# Altium project CATS-EUROC.PrjPcb
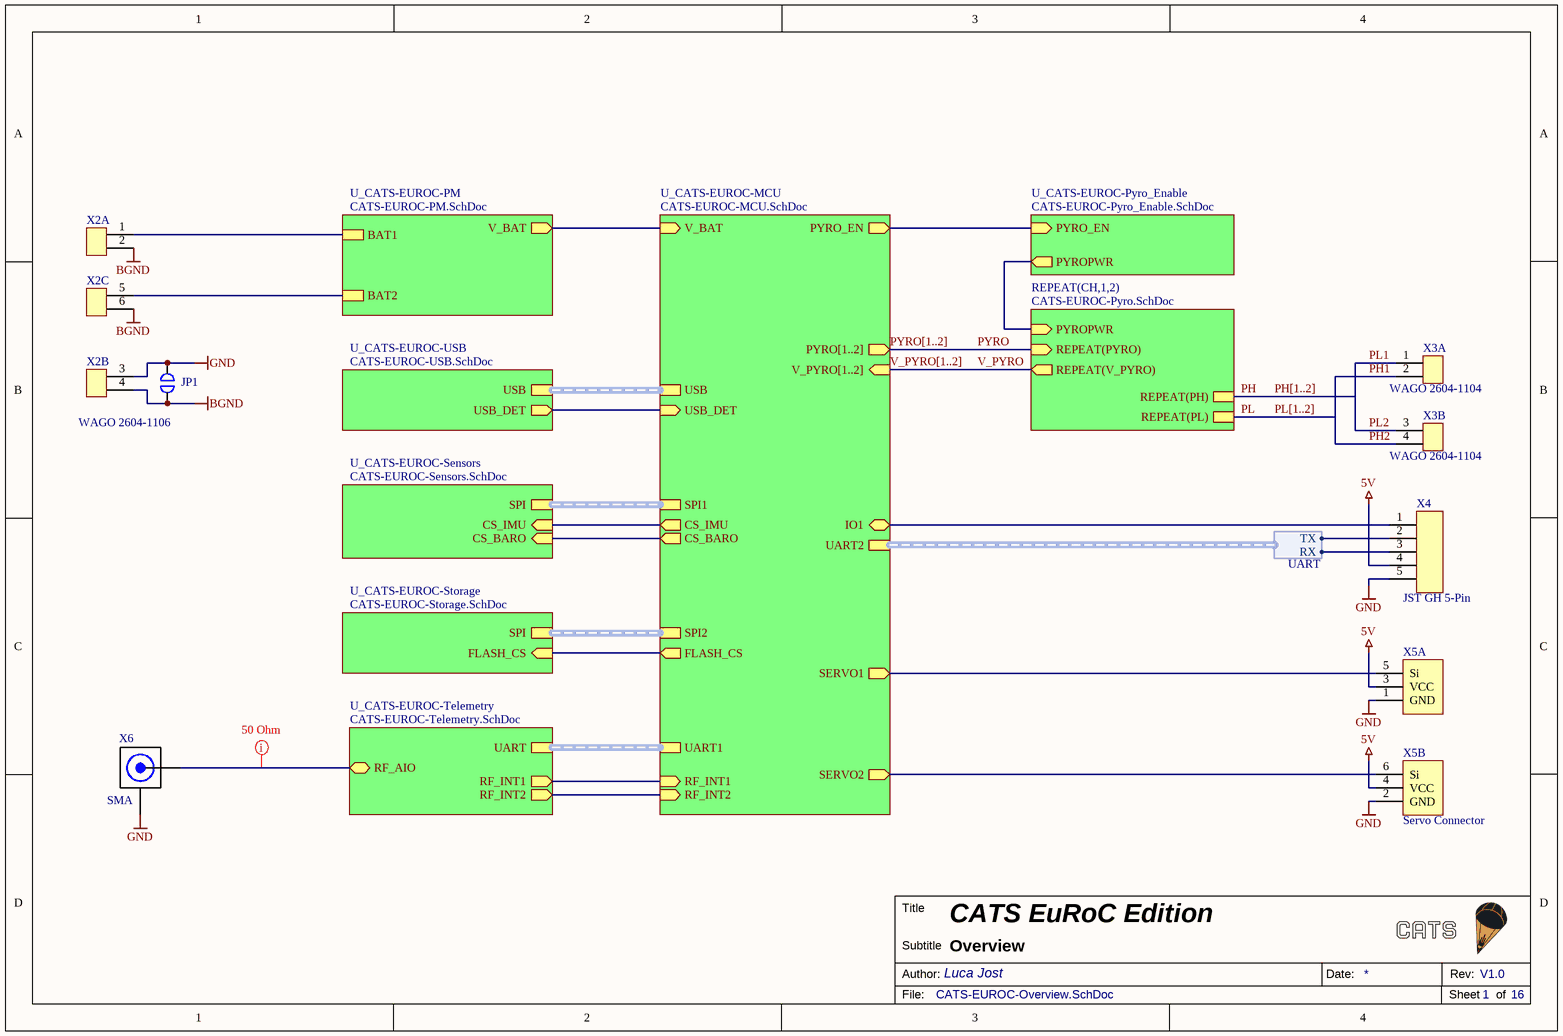
[diagram p0: CATS-EUROC-Overview.SchDoc]
16 sheets, 164 parts. Net scope: hierarchical (ports join the sheet entries above them; power ports are global).
Board file: CATS-EUROC.PcbDoc
Sheets:
  CATS-EUROC-Overview.SchDoc
    U_CATS-EUROC-Sensors = CATS-EUROC-Sensors.SchDoc
      U_CATS-EUROC-IMU = CATS-EUROC-IMU.SchDoc
      U_CATS-EUROC-Baro = CATS-EUROC-Baro.SchDoc
    U_CATS-EUROC-MCU = CATS-EUROC-MCU.SchDoc
    CH1 = CATS-EUROC-Pyro.SchDoc
    CH2 = CATS-EUROC-Pyro.SchDoc
    U_CATS-EUROC-USB = CATS-EUROC-USB.SchDoc
    U_CATS-EUROC-Pyro_Enable = CATS-EUROC-Pyro_Enable.SchDoc
    U_CATS-EUROC-Storage = CATS-EUROC-Storage.SchDoc
    U_CATS-EUROC-PM = CATS-EUROC-PM.SchDoc
    U_CATS-EUROC-Telemetry = CATS-EUROC-Telemetry.SchDoc
      U_MCU = CATS-EUROC-Radio_MCU.SchDoc
      U_RF = CATS-EUROC-RF.SchDoc
        U_Frontend = CATS-EUROC-Frontend.SchDoc
        U_Radio = CATS-EUROC-Radio.SchDoc
      U_GNSS = CATS-EUROC-GNSS.SchDoc

## Sheet CATS-EUROC-Overview.SchDoc: CATS EuRoC Edition
size A4; DocumentNumber: Overview; Revision: V1.0; SheetNumber: 1; SheetTotal: 16; Author: Luca Jost; Subtitle: Overview

### Parts
JP1  Jumper  [SMD Solder Jumper 1x2mm]  (value not drawn)  (no BOM)
X2  WAGO 2604-1106  [THT PCB Terminal Wago 2604-1106]  (value not drawn)  (parts A,B,C of 3)
X3  WAGO 2604-1104  [THT PCB Terminal Wago 2604-1104]  (parts A,B of 2)
X4  JST GH 5-Pin  [SMD Connector JST GH-5]
X5  Servo Connector  [THT Stiftleiste 6-Pol (2x3) 90°]  (value not drawn)  (parts A,B of 2)
X6  SMA  [THT Buchse SMA Female]

### Sub-sheets
REPEAT(CH,1,2) = CATS-EUROC-Pyro.SchDoc: REPEAT(V_PYRO) (out), REPEAT(PYRO) (in), REPEAT(PH), REPEAT(PL), PYROPWR (in)
U_CATS-EUROC-MCU = CATS-EUROC-MCU.SchDoc: SPI1 (harness SPI), UART1 (harness UART), USB (harness USB), V_PYRO[1..2] (in), PYRO[1..2] (out), IO1 (bidir), SERVO1 (out), SERVO2 (out), USB_DET (in), V_BAT (in), CS_IMU (out), CS_BARO (out), RF_INT1 (in), RF_INT2 (in), PYRO_EN (out), SPI2 (harness SPI), FLASH_CS (out), UART2 (harness UART)
U_CATS-EUROC-PM = CATS-EUROC-PM.SchDoc: V_BAT (out), BAT1, BAT2
U_CATS-EUROC-Pyro_Enable = CATS-EUROC-Pyro_Enable.SchDoc: PYRO_EN (in), PYROPWR (out)
U_CATS-EUROC-Sensors = CATS-EUROC-Sensors.SchDoc: CS_IMU (in), SPI, CS_BARO (in)
U_CATS-EUROC-Storage = CATS-EUROC-Storage.SchDoc: SPI (harness SPI), FLASH_CS (in)
U_CATS-EUROC-Telemetry = CATS-EUROC-Telemetry.SchDoc: UART, RF_INT1 (out), RF_INT2 (out), RF_AIO (bidir)
U_CATS-EUROC-USB = CATS-EUROC-USB.SchDoc: USB (harness USB), USB_DET (out)

### Harnesses
UART: TX, RX

### Nets
5V: X4.4 X5.3(VCC) X5.4(VCC)
BGND: JP1.2 X2.2 X2.4 X2.6
GND: JP1.1 X2.3 X4.5 X5.1(GND) X5.2(GND) X6.2(RF)
CS_BARO: sheet U_CATS-EUROC-Sensors/CS_BARO, sheet U_CATS-EUROC-MCU/CS_BARO
CS_IMU: sheet U_CATS-EUROC-Sensors/CS_IMU, sheet U_CATS-EUROC-MCU/CS_IMU
FLASH_CS: sheet U_CATS-EUROC-MCU/FLASH_CS, sheet U_CATS-EUROC-Storage/FLASH_CS
INT1: sheet U_CATS-EUROC-MCU/RF_INT1, sheet U_CATS-EUROC-Telemetry/RF_INT1
INT2: sheet U_CATS-EUROC-MCU/RF_INT2, sheet U_CATS-EUROC-Telemetry/RF_INT2
IO1: X4.1 ; sheet U_CATS-EUROC-MCU/IO1
PH: sheet REPEAT(CH,1,2)/REPEAT(PH)
PH1: X3.2 X3.4 ; sheet REPEAT(CH,1,2)/PYROPWR, sheet U_CATS-EUROC-Pyro_Enable/PYROPWR  [also labelled PH2]
PL: sheet REPEAT(CH,1,2)/REPEAT(PL)
PL1: X3.1
PL2: X3.3
PYRO: sheet REPEAT(CH,1,2)/REPEAT(PYRO)
PYRO_EN: sheet U_CATS-EUROC-MCU/PYRO_EN, sheet U_CATS-EUROC-Pyro_Enable/PYRO_EN
SERVO1: X5.5(Si) ; sheet U_CATS-EUROC-MCU/SERVO1
SERVO2: X5.6(Si) ; sheet U_CATS-EUROC-MCU/SERVO2
UART2_RX: X4.3 ; sheet U_CATS-EUROC-MCU/UART2.RX
UART2_TX: X4.2 ; sheet U_CATS-EUROC-MCU/UART2.TX
USB_DET: sheet U_CATS-EUROC-MCU/USB_DET, sheet U_CATS-EUROC-USB/USB_DET
V_BAT: sheet U_CATS-EUROC-MCU/V_BAT, sheet U_CATS-EUROC-PM/V_BAT
V_PYRO: sheet REPEAT(CH,1,2)/REPEAT(V_PYRO)
NetD1_A: X2.1 ; sheet U_CATS-EUROC-PM/BAT1
NetD2_A: X2.5 ; sheet U_CATS-EUROC-PM/BAT2
NetFL1_5: X6.1(RF) ; sheet U_CATS-EUROC-Telemetry/RF_AIO

### Buses and harness runs
bus PH[1..2]
bus PL[1..2]
bus PYRO[1..2] = sheet U_CATS-EUROC-MCU/PYRO[1..2]
bus V_PYRO[1..2] = sheet U_CATS-EUROC-MCU/V_PYRO[1..2]
harness sheet U_CATS-EUROC-MCU/SPI1 = sheet U_CATS-EUROC-Sensors/SPI
harness sheet U_CATS-EUROC-MCU/SPI2 = sheet U_CATS-EUROC-Storage/SPI
harness sheet U_CATS-EUROC-MCU/UART1 = sheet U_CATS-EUROC-Telemetry/UART
harness sheet U_CATS-EUROC-MCU/USB = sheet U_CATS-EUROC-USB/USB

### Layout directives
rule Impedance Constraint [Min = 50.00    Max = 50.00    ]; net class RF-Line 50: NetFL1_5

### Notes on the sheet
- Title
- Author:
- Subtitle
- Date:
- Rev:
- File:
- Sheet
- of

### Library data of the parts
JP1 = Jumper-1: Single Position Jumper
X2 = WAGO 2604-1106: PCB terminal blocks with levers and Push-in CAGE CLAMP® connection; ComponentLink1Description: Datasheet; ComponentLink1URL: https://www.wago.com/us/pcb-interconnect/pcb-terminal-block/p/2604-1106
X3 = WAGO 2604-1104: PCB terminal blocks with levers and Push-in CAGE CLAMP® connection; ComponentLink1Description: Datasheet; ComponentLink1URL: https://www.wago.com/us/pcb-interconnect/pcb-terminal-block/p/2604-1106
X4 = JST GH 5-Pin: Connector Header Surface Mount, Right Angle 4 position 0.049" (1.25mm); ComponentLink1Description: Datasheet; ComponentLink1URL: https://www.jst-mfg.com/product/pdf/eng/eGH.pdf
X5 = Servo Connector Dual: 6 Pin header for PWM servos
X6 = SMA Connector: Female SMA Connector THT; Digikey: 931-1361-ND

## Sheet CATS-EUROC-Sensors.SchDoc: CATS EuRoC Edition
size A4; DocumentNumber: Overview; Revision: V1.0; SheetNumber: 5; SheetTotal: 16; Author: Luca Jost; Subtitle: Sensors
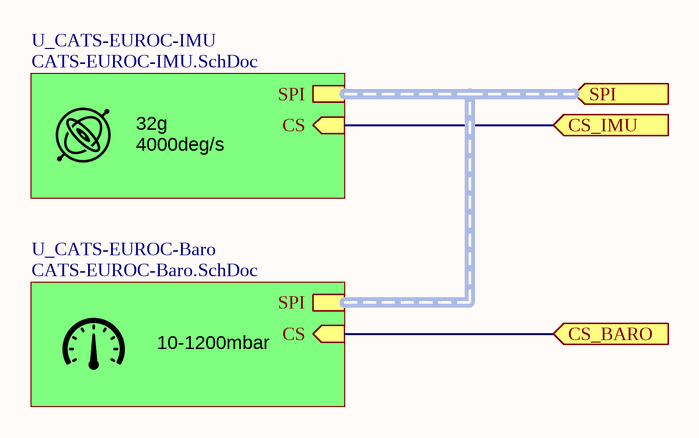
[diagram p1: CATS-EUROC-Sensors.SchDoc]

### Sub-sheets
U_CATS-EUROC-Baro = CATS-EUROC-Baro.SchDoc: SPI (harness SPI), CS (in)
U_CATS-EUROC-IMU = CATS-EUROC-IMU.SchDoc: SPI (harness SPI), CS (in)

### Ports
CS_BARO (in), CS_IMU (in), SPI (in)

### Nets
CS_BARO: port CS_BARO, sheet U_CATS-EUROC-Baro/CS
CS_IMU: port CS_IMU, sheet U_CATS-EUROC-IMU/CS

### Buses and harness runs
harness port SPI = sheet U_CATS-EUROC-Baro/SPI = sheet U_CATS-EUROC-IMU/SPI

### Notes on the sheet
- 4000deg/s
- 32g
- 10-1200mbar
- Title
- Author:
- Subtitle
- Date:
- Rev:
- File:
- Sheet
- of

## Sheet CATS-EUROC-IMU.SchDoc: CATS EuRoC Edition
size A4; DocumentNumber: Overview; Revision: V1.0; SheetNumber: 6; SheetTotal: 16; Author: Luca Jost; Subtitle: Inertial Measurement Unit
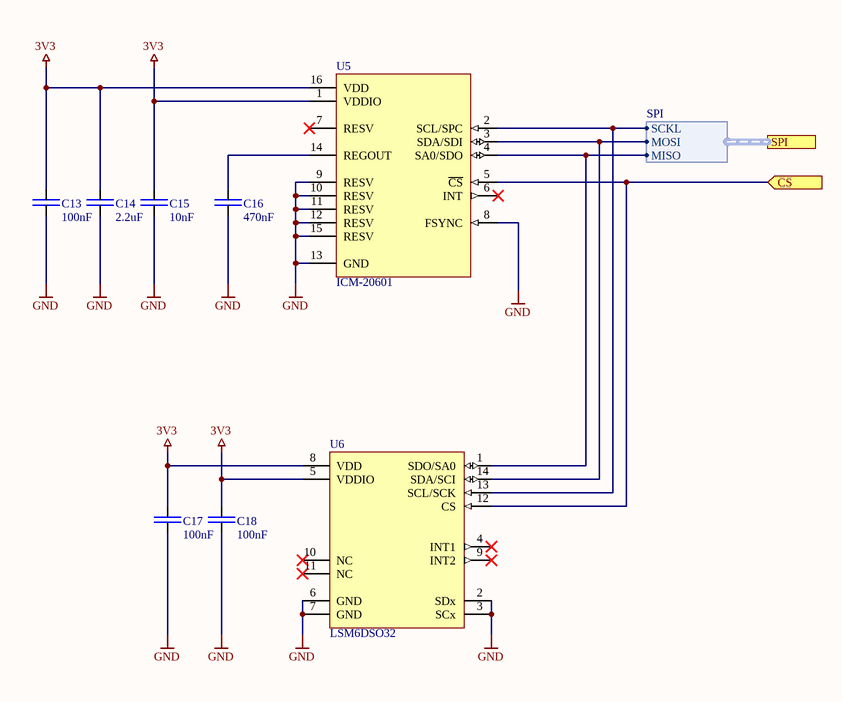
[diagram p2: CATS-EUROC-IMU.SchDoc]

### Parts
C13  100nF  [SMD Keramikkondensator 0402]
C14  2.2uF  [SMD Keramikkondensator 0402]
C15  10nF  [SMD Keramikkondensator 0402]
C16  470nF  [SMD Keramikkondensator 0402]
C17  100nF  [SMD Keramikkondensator 0402]
C18  100nF  [SMD Keramikkondensator 0402]
U5  ICM-20601  [SMD IC LGA-16 5/3]
U6  LSM6DSO32  [SMD IC LGA-14]

### Ports
CS (in), SPI (harness SPI)

### Harnesses
SPI: SCKL, MOSI, MISO

### Nets
3V3: C13.2 C14.2 C15.2 C17.2 C18.2 U5.1(VDDIO) U5.16(VDD) U6.5(VDDIO) U6.8(VDD)
GND: C13.1 C14.1 C15.1 C16.1 C17.1 C18.1 U5.8(FSYNC) U5.9(RESV) U5.10(RESV) U5.11(RESV) U5.12(RESV) U5.13(GND) U5.15(RESV) U6.2(SDx) U6.3(SCx) U6.6(GND) U6.7(GND)
CS_IMU: U5.5(~{CS}) U6.12(CS) ; port CS
SPI1_MISO: U5.4(SA0/SDO) U6.1(SDO/SA0) ; port SPI.MISO
SPI1_MOSI: U5.3(SDA/SDI) U6.14(SDA/SCI) ; port SPI.MOSI
SPI1_SCK: U5.2(SCL/SPC) U6.13(SCL/SCK) ; port SPI.SCKL
NetC16_2: C16.2 U5.14(REGOUT)

Not connected (* = marked no-connect by the designer): U5 6(INT)* 7(RESV)*; U6 4(INT1)* 9(INT2)* 10(NC)* 11(NC)*

### Notes on the sheet
- Title
- Author:
- Subtitle
- Date:
- Rev:
- File:
- Sheet
- of

### Library data of the parts
C13 C17 C18 = E6 - 100nF: SMD Ceramic Capacitor E6; Unit Price: 0.01; Number: -; Supplier: -; JLC: C307331
C14 = E6 - 2.2uF: SMD Ceramic Capacitor E6; Unit Price: 0.01; Number: -; Supplier: -; JLC: C12530
C15 = E6 - 10nF: SMD Ceramic Capacitor E6; Unit Price: 0.01; Number: -; Supplier: -; JLC: C15195
C16 = E6 - 470nF: SMD Ceramic Capacitor E6; Unit Price: 0.01; Number: -; Supplier: -; JLC: C47339
U5 = ICM-20601: World’s First Wide-Range 6-Axis MotionTracking Device for High Speed Applications /; ComponentLink1Description: Datasheet; ComponentLink1URL: https://www.invensense.com/wp-content/uploads/2015/12/DS-000184-ICM-20600-v1.0.pdf; Digikey: 1428-1058-1-ND
U6 = LSM6DSO32: iNEMO inertial module / ±4/±8/±16/±32 g / ±125/±250/±500/±1000/±2000 dps; ComponentLink1Description: Datasheet; ComponentLink1URL: https://www.st.com/resource/en/datasheet/lsm6dso32.pdf; Digikey: 497-LSM6DSO32CT-ND; Mouser: 511-LSM6DSO32TR; Farnell: 3527117

## Sheet CATS-EUROC-Baro.SchDoc: CATS EuRoC Edition
size A4; DocumentNumber: Overview; Revision: V1.0; SheetNumber: 7; SheetTotal: 16; Author: Luca Jost; Subtitle: Barometer
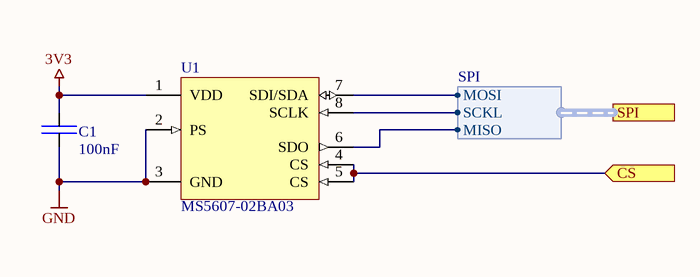
[diagram p3: CATS-EUROC-Baro.SchDoc]

### Parts
C1  100nF  [SMD Keramikkondensator 0402]
U1  MS5607-02BA03  [SMD IC BARO MS5607]

### Ports
CS (in), SPI (harness SPI)

### Harnesses
SPI: SCKL, MOSI, MISO

### Nets
3V3: C1.2 U1.1(VDD)
GND: C1.1 U1.2(PS) U1.3(GND)
CS_BARO: U1.4(CS) U1.5(CS) ; port CS
SPI1_MISO: U1.6(SDO) ; port SPI.MISO
SPI1_MOSI: U1.7(SDI/SDA) ; port SPI.MOSI
SPI1_SCK: U1.8(SCLK) ; port SPI.SCKL

### Notes on the sheet
- Title
- Author:
- Subtitle
- Date:
- Rev:
- File:
- Sheet
- of

### Library data of the parts
C1 = E6 - 100nF: SMD Ceramic Capacitor E6; Unit Price: 0.01; Number: -; Supplier: -; JLC: C307331
U1 = MS5607-02BA03: Barometric Pressure Sensor, with stainless / steel cap; ComponentLink1Description: Datasheet; ComponentLink1URL: https://www.te.com/commerce/DocumentDelivery/DDEController?Action=srchrtrv&DocNm=MS5607-02BA03&DocType=Data+Sheet&DocLang=English; Digikey: 223-1198-1-ND

## Sheet CATS-EUROC-MCU.SchDoc: CATS EuRoC Edition
size A4; DocumentNumber: Overview; Revision: V1.0; SheetNumber: 2; SheetTotal: 16; Author: Luca Jost; Subtitle: Microcontroller
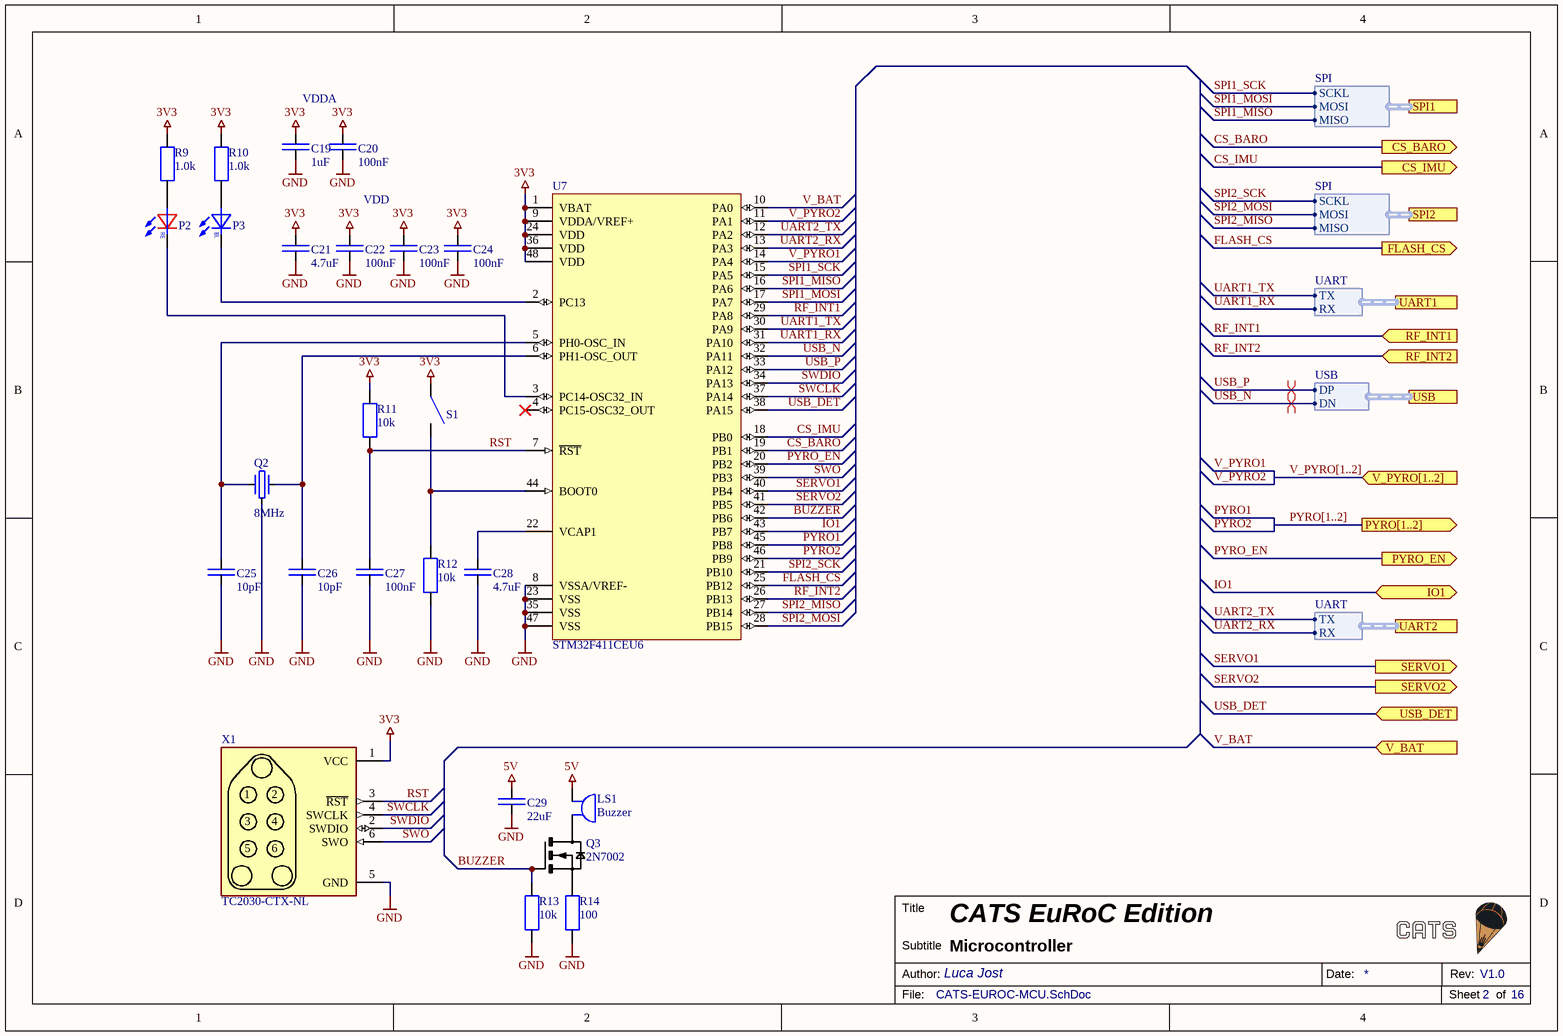
[diagram p4: CATS-EUROC-MCU.SchDoc]

### Parts
C19  1uF  [SMD Keramikkondensator 0402]
C20  100nF  [SMD Keramikkondensator 0402]
C21  4.7uF  [SMD Keramikkondensator 0402]
C22  100nF  [SMD Keramikkondensator 0402]
C23  100nF  [SMD Keramikkondensator 0402]
C24  100nF  [SMD Keramikkondensator 0402]
C25  10pF  [SMD Keramikkondensator 0402]
C26  10pF  [SMD Keramikkondensator 0402]
C27  100nF  [SMD Keramikkondensator 0402]
C28  4.7uF  [SMD Keramikkondensator 0402]
C29  22uF  [SMD Keramikkondensator 0805]
LS1  Buzzer  [SMD BUZZER CMT-8504]
P2  LED  [SMD LED 0603]  (value not drawn)
P3  LED  [SMD LED 0603]  (value not drawn)
Q2  8MHz  [SMD Crystal 3.2X2.5X0.8]
Q3  2N7002  [SMD MOSFET SOT-23]
R9  1.0k  [SMD Widerstand 0402]
R10  1.0k  [SMD Widerstand 0402]
R11  10k  [SMD Widerstand 0402]
R12  10k  [SMD Widerstand 0402]
R13  10k  [SMD Widerstand 0402]
R14  100  [SMD Widerstand 0805]
S1  SMD-Button  [SMD Button 2.5x3x1.2]  (value not drawn)
U7  STM32F411CEU6  [SMD IC QFN-48]
X1  TC2030-CTX-NL  [SMD Connector TC2030]  (no BOM)

### Ports
CS_BARO (out), CS_IMU (out), FLASH_CS (out), IO1 (bidir), PYRO[1..2] (out), PYRO_EN (out), RF_INT1 (in), RF_INT2 (in), SERVO1 (out), SERVO2 (out), SPI1 (harness SPI), SPI2 (harness SPI), UART1 (harness UART), UART2 (harness UART), USB (harness USB), USB_DET (in), V_BAT (in), V_PYRO[1..2] (in)

### Harnesses
SPI: SCKL, MOSI, MISO
UART: TX, RX
USB: DP, DN

### Nets
3V3: C19.2 C20.2 C21.2 C22.2 C23.2 C24.2 R9.2 R10.2 R11.2 S1.1 U7.1(VBAT) U7.9(VDDA/VREF+) U7.24(VDD) U7.36(VDD) U7.48(VDD) X1.1(VCC)
5V: C29.2 LS1.1
GND: C19.1 C20.1 C21.1 C22.1 C23.1 C24.1 C25.1 C26.1 C27.1 C28.1 C29.1 Q2.3 R12.1 R13.1 R14.1 U7.8(VSSA/VREF-) U7.23(VSS) U7.35(VSS) U7.47(VSS) X1.5(GND)
BUZZER: Q3.G R13.2 U7.42(PB6)
CS_BARO: U7.19(PB1) ; port CS_BARO
CS_IMU: U7.18(PB0) ; port CS_IMU
FLASH_CS: U7.25(PB12) ; port FLASH_CS
IO1: U7.43(PB7) ; port IO1
PYRO1: U7.45(PB8)
PYRO2: U7.46(PB9)
PYRO_EN: U7.20(PB2) ; port PYRO_EN
RF_INT1: U7.29(PA8) ; port RF_INT1  [project net INT1]
RF_INT2: U7.26(PB13) ; port RF_INT2  [project net INT2]
RST: C27.2 R11.1 U7.7(~{RST}) X1.3(~{RST})
SERVO1: U7.40(PB4) ; port SERVO1
SERVO2: U7.41(PB5) ; port SERVO2
SPI1_MISO: U7.16(PA6) ; port SPI1.MISO
SPI1_MOSI: U7.17(PA7) ; port SPI1.MOSI
SPI1_SCK: U7.15(PA5) ; port SPI1.SCKL
SPI2_MISO: U7.27(PB14) ; port SPI2.MISO
SPI2_MOSI: U7.28(PB15) ; port SPI2.MOSI
SPI2_SCK: U7.21(PB10) ; port SPI2.SCKL
SWCLK: U7.37(PA14) X1.4(SWCLK)
SWDIO: U7.34(PA13) X1.2(SWDIO)
SWO: U7.39(PB3) X1.6(SWO)
UART1_RX: U7.31(PA10) ; port UART1.RX  [project net TX2]
UART1_TX: U7.30(PA9) ; port UART1.TX  [project net RX2]
UART2_RX: U7.13(PA3) ; port UART2.RX
UART2_TX: U7.12(PA2) ; port UART2.TX
USB_DET: U7.38(PA15) ; port USB_DET
USB_N: U7.32(PA11) ; port USB.DN
USB_P: U7.33(PA12) ; port USB.DP
V_BAT: U7.10(PA0) ; port V_BAT
V_PYRO1: U7.14(PA4)
V_PYRO2: U7.11(PA1)
NetC25_2: C25.2 Q2.1 U7.5(PH0-OSC_IN)
NetC26_2: C26.2 Q2.2 U7.6(PH1-OSC_OUT)
NetC28_2: C28.2 U7.22(VCAP1)
NetLS1_2: LS1.2 Q3.D
NetP2_A: P2.A R9.1
NetP2_K: P2.K U7.3(PC14-OSC32_IN)
NetP3_A: P3.A R10.1
NetP3_K: P3.K U7.2(PC13)
NetQ3_S: Q3.S R14.2
NetR12_2: R12.2 S1.2 U7.44(BOOT0)

Not connected (* = marked no-connect by the designer): U7 4(PC15-OSC32_OUT)*

### Buses and harness runs
bus PYRO[1..2] = port PYRO[1..2]
bus V_PYRO[1..2] = port V_PYRO[1..2]

### Layout directives
differential pair: USB_N, USB_P

### Notes on the sheet
- VDDA
- VDD
- Title
- Author:
- Subtitle
- Date:
- Rev:
- File:
- Sheet
- of
- (in symbol LED) BL; RE

### Library data of the parts
C19 = E6 - 1uF: SMD Ceramic Capacitor E6; Unit Price: 0.01; Number: -; Supplier: -; JLC: C52923
C20 C22-C24 C27 = E6 - 100nF: SMD Ceramic Capacitor E6; Unit Price: 0.01; Number: -; Supplier: -; JLC: C307331
C21 C28 = E6 - 4.7uF: SMD Ceramic Capacitor E6; Unit Price: 0.01; Number: -; Supplier: -; JLC: C23733
C25 C26 = E6 - 10pF: SMD Ceramic Capacitor E6; Unit Price: 0.01; Number: -; Supplier: -; JLC: C32949
C29 = E6 - 22uF: SMD Ceramic Capacitor E6; Unit Price: 0.01; Number: -; Supplier: -; JLC: C45783
LS1 = Buzzer: Buzzers Indicator, Internally Driven Piezo 12V 10mA 3kHz 100dB @ 12V, 10cm Through Hole PC Pins; Digikey: 2104-IP303012-1-ND; ComponentLink1Description: Datasheet; ComponentLink1URL: https://dbunlimitedco.com/images/product_images/2D-Drawings/IP303012-1.pdf
P2 P3 = LED: Color LED
Q2 = Crystal: SMD Crystal Resonators 8MHz ±10ppm SMD,3.2x2.5mm; Digikey: 535-15255-1-ND; JLC: C2682775
Q3 = 2N7002: MOSFET N-Channel 20V / 115mA; Item Description: N-Channel MOSFET; Digikey: 2N7002NCT-ND; Price: 0.32; ComponentLink1Description: Datasheet; ComponentLink1URL: https://www.onsemi.com/pub/Collateral/NDS7002A-D.PDF; JLC: C15127
R9 R10 = E24 - 1.0k: SMD Chip Resistor E24; Unit Price: 0.01; Number: -; Supplier: -; JLC: C11702
R11-R13 = E24 - 10k: SMD Chip Resistor E24; Unit Price: 0.01; Number: -; Supplier: -; JLC: C25744
R14 = E24 - 100: SMD Chip Resistor E24; Unit Price: 0.01; Number: -; Supplier: -; JLC: C515718
S1 = Button 3mmx2.5mm: Button SPST; Digikey: SW1020TR-ND; JLC: C128937
U7 = STM32F411CEU6: ARM® Cortex®-M4 series Microcontroller IC 32-Bit 100MHz 512KB (512K x 8) FLASH 48-UFQFPN (7x7); Digikey: 497-14907-ND; JLC: C60420; ComponentLink1Description: Datasheet; ComponentLink1URL: https://datasheet.lcsc.com/lcsc/1809291612_STMicroelectronics-STM32F411CEU6_C60420.pdf
X1 = TC2030-CTX-NL: Tag-Connect for ARM-Cortex (6-Pin)

## Sheet CATS-EUROC-Pyro.SchDoc: CATS EuRoC Edition
size A4; DocumentNumber: Overview; Revision: V1.0; SheetNumber: 10; SheetTotal: 16; Author: Luca Jost; Subtitle: Pyro Channel
Used 2 times, as channels CH1, CH2. Parts and nets are listed once, with the designators drawn on the sheet.
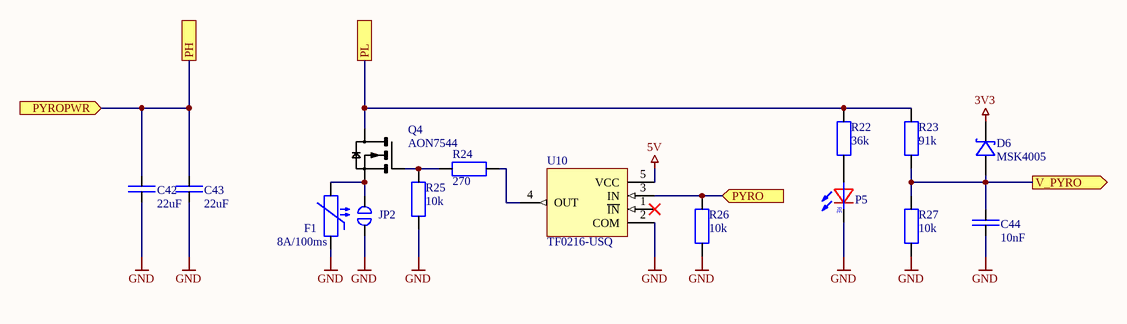
[diagram p5: CATS-EUROC-Pyro.SchDoc]

### Parts
C42  22uF  [SMD Keramikkondensator 0805]
C43  22uF  [SMD Keramikkondensator 0805]
C44  10nF  [SMD Keramikkondensator 0402]
D6  MSK4005  [SMD Diode SOD-523]
F1  8A/100ms  [SMD PPTC-Fuse 1206]
JP2  Jumper  [SMD Solder Jumper 1x2mm]  (value not drawn)  (no BOM)
P5  LED  [SMD LED 0603]  (value not drawn)
Q4  AON7544  [SMD MOSFET DFN 3x3 EP]
R22  36k  [SMD Widerstand 0402]
R23  91k  [SMD Widerstand 0402]
R24  270  [SMD Widerstand 0402]
R25  10k  [SMD Widerstand 0402]
R26  10k  [SMD Widerstand 0402]
R27  10k  [SMD Widerstand 0402]
U10  TF0216-USQ  [SMD IC SOT-23-5]

### Ports
PH, PL, PYRO (in), PYROPWR (in), V_PYRO (out)

### Nets
3V3: D6.K
5V: U10.5(VCC)
GND: C42.1 C43.1 C44.1 F1.2 JP2.2 P5.K R25.1 R26.1 R27.1 U10.2(COM)
PH: C42.2 C43.2 ; port PH, port PYROPWR
PL: Q4.D R22.2 R23.2 ; port PL
PYRO: R26.2 U10.3(IN) ; port PYRO
V_PYRO: C44.2 D6.A R23.1 R27.2 ; port V_PYRO
NetF1_1: F1.1 JP2.1 Q4.S
NetP5_A: P5.A R22.1
NetQ4_G: Q4.G R24.1 R25.2
NetR24_2: R24.2 U10.4(OUT)

Not connected (* = marked no-connect by the designer): U10 1(~{IN})*

### Channels
CH1: designators end in _CH1; ports PH=PH1 PL=PL1 PYRO=PYRO1 PYROPWR=PH1 V_PYRO=V_PYRO1
CH2: designators end in _CH2; ports PH=PH1 PL=PL2 PYRO=PYRO2 PYROPWR=PH1 V_PYRO=V_PYRO2

### Notes on the sheet
- Title
- Author:
- Subtitle
- Date:
- Rev:
- File:
- Sheet
- of
- (in symbol LED) RE

### Library data of the parts
C42 C43 = E6 - 22uF: SMD Ceramic Capacitor E6; Unit Price: 0.01; Number: -; Supplier: -; JLC: C45783
C44 = E6 - 10nF: SMD Ceramic Capacitor E6; Unit Price: 0.01; Number: -; Supplier: -; JLC: C15195
D6 = MSK4005: SOD-523 Schottky Barrier Diode; ComponentLink1Description: Datasheet; ComponentLink1URL: https://datasheet.lcsc.com/lcsc/1912111437_Shikues-MSK4005_C345957.pdf; JLC: C345957
F1 = nSMD100-16V: 16V 1A 100A 1.8A 1206 Resettable; JLC: C70082; ComponentLink1Description: Datasheet; ComponentLink1URL: https://datasheet.lcsc.com/lcsc/1810261625_TECHFUSE-nSMD100-16V_C70082.pdf
JP2 = Jumper-1: Single Position Jumper
P5 = LED: Color LED
Q4 = AON7544: N-Channel 30V 30A Surface Mount 8-DFN (3x3); ComponentLink1Description: Datasheet; ComponentLink1URL: https://datasheet.lcsc.com/lcsc/1912111437_Alpha---Omega-Semicon-AON7544_C315567.pdf; JLC: C315567
R22 = E24 - 36k: SMD Chip Resistor E24; Unit Price: 0.01; Number: -; Supplier: -; JLC: C43676
R23 = E24 - 91k: SMD Chip Resistor E24; Unit Price: 0.01; Number: -; Supplier: -; JLC: C4147
R24 = E24 - 270: SMD Chip Resistor E24; Unit Price: 0.01; Number: -; Supplier: -; JLC: C25099
R25-R27 = E24 - 10k: SMD Chip Resistor E24; Unit Price: 0.01; Number: -; Supplier: -; JLC: C25744
U10 = TF0216-USQ: SOT-23-5L Gate Drive IC; JLC: C2683769; ComponentLink1Description: Datasheet; ComponentLink1URL: https://datasheet.lcsc.com/lcsc/2106070334_TFSS-TF0216-USQ_C2683769.pdf

## Sheet CATS-EUROC-USB.SchDoc: CATS EuRoC Edition
size A4; DocumentNumber: Overview; Revision: V1.0; SheetNumber: 4; SheetTotal: 16; Author: Luca Jost; Subtitle: USB Connector
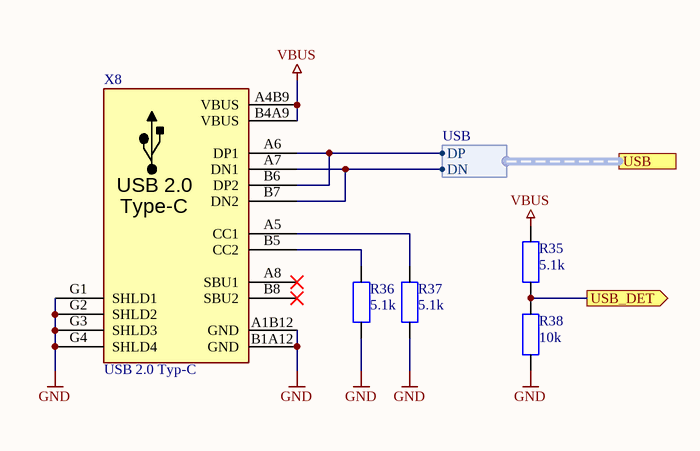
[diagram p6: CATS-EUROC-USB.SchDoc]

### Parts
R35  5.1k  [SMD Widerstand 0402]
R36  5.1k  [SMD Widerstand 0402]
R37  5.1k  [SMD Widerstand 0402]
R38  10k  [SMD Widerstand 0402]
X8  USB 2.0 Typ-C  [THT USB-C Socket (A40-00119)]

### Ports
USB (harness USB), USB_DET (out)

### Harnesses
USB: DP, DN

### Nets
GND: R36.1 R37.1 R38.2 X8.A1B12(GND) X8.B1A12(GND) X8.G1(SHLD1) X8.G2(SHLD2) X8.G3(SHLD3) X8.G4(SHLD4)
VBUS: R35.1 X8.A4B9(VBUS) X8.B4A9(VBUS)
USB_DET: R35.2 R38.1 ; port USB_DET
USB_N: X8.A7(DN1) X8.B7(DN2) ; port USB.DN
USB_P: X8.A6(DP1) X8.B6(DP2) ; port USB.DP
NetR36_2: R36.2 X8.B5(CC2)
NetR37_2: R37.2 X8.A5(CC1)

Not connected (* = marked no-connect by the designer): X8 A8(SBU1)* B8(SBU2)*

### Notes on the sheet
- Title
- Author:
- Subtitle
- Date:
- Rev:
- File:
- Sheet
- of
- (in symbol USB Type-C USB 2.0) USB 2.0; Type-C

### Library data of the parts
R35-R37 = E24 - 5.1k: SMD Chip Resistor E24; Unit Price: 0.01; Number: -; Supplier: -; JLC: C25905
R38 = E24 - 10k: SMD Chip Resistor E24; Unit Price: 0.01; Number: -; Supplier: -; JLC: C25744
X8 = USB Type-C USB 2.0: Typ-C; aliExpress: 33045191307; Digikey: 2073-USB4105-GF-ACT-ND; Farnell: 3583366; JLC: C167321

## Sheet CATS-EUROC-Pyro_Enable.SchDoc: CATS EuRoC Edition
size A4; DocumentNumber: Overview; Revision: V1.0; SheetNumber: 9; SheetTotal: 16; Author: Luca Jost; Subtitle: Pyro Power Enable
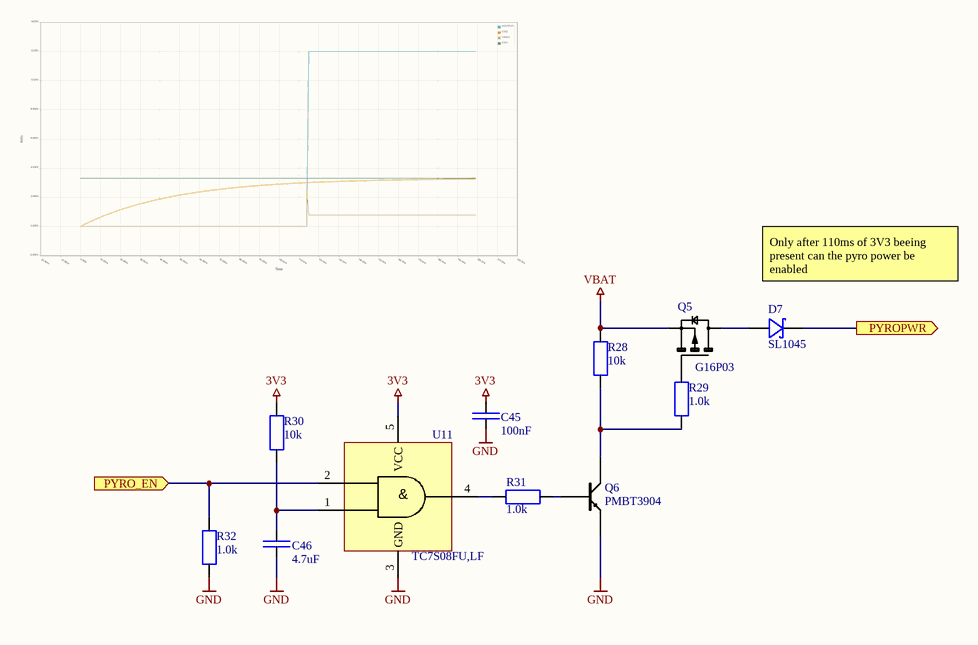
[diagram p7: CATS-EUROC-Pyro_Enable.SchDoc]

### Parts
C45  100nF  [SMD Keramikkondensator 0402]
C46  4.7uF  [SMD Keramikkondensator 0402]
D7  SL1045  [SMD Diode TO-277]
Q5  G16P03  [SMD MOSFET DFN 3x3 EP]
Q6  PMBT3904  [SMD Transistor SOT-23]
R28  10k  [SMD Widerstand 0402]
R29  1.0k  [SMD Widerstand 0402]
R30  10k  [SMD Widerstand 0402]
R31  1.0k  [SMD Widerstand 0402]
R32  1.0k  [SMD Widerstand 0402]
U11  TC7S08FU,LF  [SMD IC SSOP5-P-0.65A (SOT353-1)]

### Ports
PYRO_EN (in), PYROPWR (out)

### Nets
3V3: C45.2 R30.2 U11.5(VCC)
GND: C45.1 C46.1 Q6.E R32.1 U11.3(GND)
VBAT: Q5.S R28.2
PH1: D7.K ; port PYROPWR
PYRO_EN: R32.2 U11.2(IN) ; port PYRO_EN
NetC46_2: C46.2 R30.1 U11.1(IN)
NetD7_A: D7.A Q5.D
NetQ5_G: Q5.G R29.2
NetQ6_B: Q6.B R31.1
NetQ6_C: Q6.C R28.1 R29.1
NetR31_2: R31.2 U11.4(OUT)

### Notes on the sheet
- Only after 110ms of 3V3 beeing present can the pyro power be enabled
- Title
- Author:
- Subtitle
- Date:
- Rev:
- File:
- Sheet
- of
- (in symbol TC7S08FU,LF) &

### Library data of the parts
C45 = E6 - 100nF: SMD Ceramic Capacitor E6; Unit Price: 0.01; Number: -; Supplier: -; JLC: C307331
C46 = E6 - 4.7uF: SMD Ceramic Capacitor E6; Unit Price: 0.01; Number: -; Supplier: -; JLC: C23733
D7 = SL1045: 45V 470mV@10A 10A TO-277 Schottky Barrier Diodes; ComponentLink1Description: Datasheet; ComponentLink1URL: https://datasheet.lcsc.com/lcsc/1810252210_MDD-Microdiode-Electronics--SL1045_C65021.pdf; JLC: C113945
Q5 = G16P03: 30V 16A 35W; ComponentLink1Description: Datasheet; ComponentLink1URL: https://datasheet.lcsc.com/lcsc/1809251724_GOFORD-G16P03_C193982.pdf; JLC: C471913
Q6 = PMBT3904: 40 V, 200 mA NPN switching transisto; ComponentLink1Description: Datasheet; ComponentLink1URL: https://datasheet.lcsc.com/lcsc/2105201004_Nexperia-PMBT3904-215_C8667.pdf; JLC: C8667
R28 R30 = E24 - 10k: SMD Chip Resistor E24; Unit Price: 0.01; Number: -; Supplier: -; JLC: C25744
R29 R31 R32 = E24 - 1.0k: SMD Chip Resistor E24; Unit Price: 0.01; Number: -; Supplier: -; JLC: C11702
U11 = TC7S08FU,LF: AND Gate SSOP5-P-0.65A; ComponentLink1Description: Datasheet; ComponentLink1URL: https://datasheet.lcsc.com/lcsc/1811082031_TOSHIBA-TC7S08FU-LF_C146362.pdf; JLC: C146362

## Sheet CATS-EUROC-Storage.SchDoc: CATS EuRoC Edition
size A4; DocumentNumber: Overview; Revision: V1.0; SheetNumber: 8; SheetTotal: 16; Author: Luca Jost; Subtitle: Storage
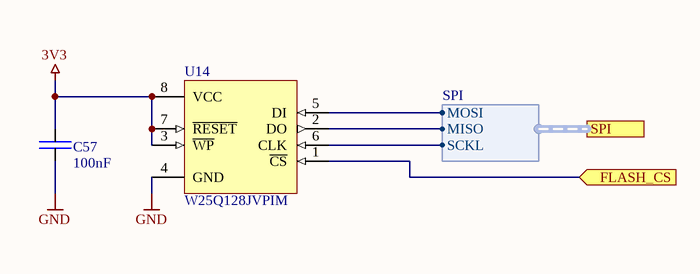
[diagram p8: CATS-EUROC-Storage.SchDoc]

### Parts
C57  100nF  [SMD Keramikkondensator 0402]
U14  W25Q128JVPIM  [SMD IC WSON-8 (6x5)]

### Ports
FLASH_CS (in), SPI (harness SPI)

### Harnesses
SPI: SCKL, MOSI, MISO

### Nets
3V3: C57.2 U14.3(~{WP}) U14.7(~{RESET}) U14.8(VCC)
GND: C57.1 U14.4(GND)
FLASH_CS: U14.1(~{CS}) ; port FLASH_CS
SPI2_MISO: U14.2(DO) ; port SPI.MISO
SPI2_MOSI: U14.5(DI) ; port SPI.MOSI
SPI2_SCK: U14.6(CLK) ; port SPI.SCKL

### Notes on the sheet
- Title
- Author:
- Subtitle
- Date:
- Rev:
- File:
- Sheet
- of

### Library data of the parts
C57 = E6 - 100nF: SMD Ceramic Capacitor E6; Unit Price: 0.01; Number: -; Supplier: -; JLC: C307331
U14 = W25Q128JVPIM: 3V 128M-BIT / SERIAL FLASH MEMORY WITH / DUAL/QUAD SPI & QPI & DTR; ComponentLink1Description: Datasheet; ComponentLink1URL: https://www.winbond.com/resource-files/w25q128jv_dtr%20revc%2003272018%20plus.pdf; Digikey: W25Q128JVPIM-ND; JLC: C190862

## Sheet CATS-EUROC-PM.SchDoc: CATS EuRoC Edition
size A4; DocumentNumber: Overview; Revision: V1.0; SheetNumber: 3; SheetTotal: 16; Author: Luca Jost; Subtitle: Power Management
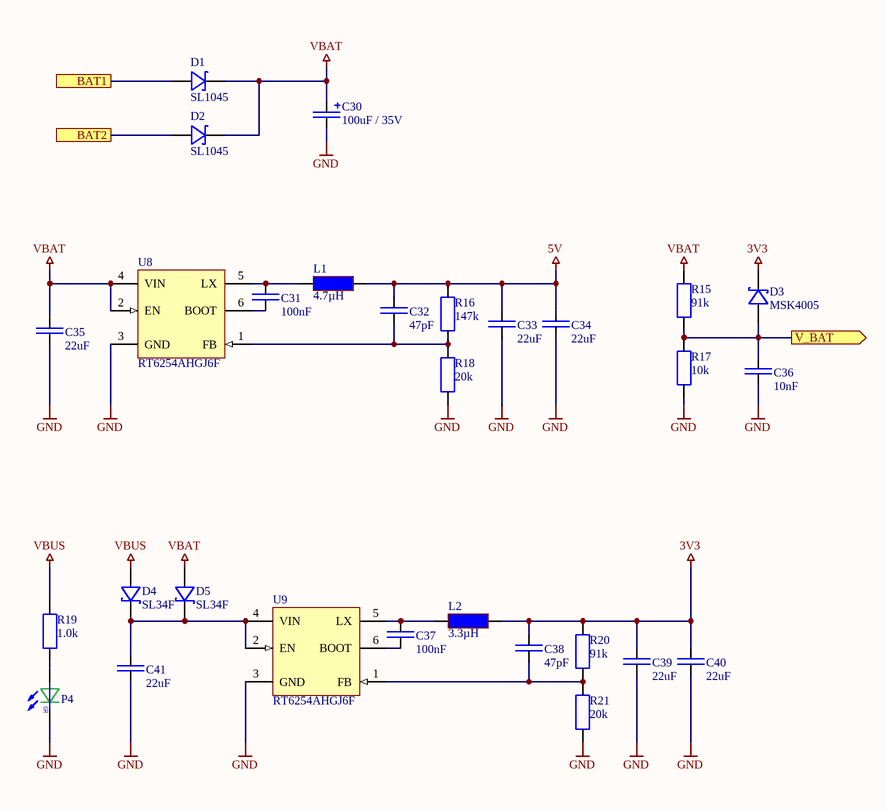
[diagram p9: CATS-EUROC-PM.SchDoc]

### Parts
C30  100uF / 35V  [SMD Elko 6.3x7.7]
C31  100nF  [SMD Keramikkondensator 0402]
C32  47pF  [SMD Keramikkondensator 0402]
C33  22uF  [SMD Keramikkondensator 0805]
C34  22uF  [SMD Keramikkondensator 0805]
C35  22uF  [SMD Keramikkondensator 0805]
C36  10nF  [SMD Keramikkondensator 0402]
C37  100nF  [SMD Keramikkondensator 0402]
C38  47pF  [SMD Keramikkondensator 0402]
C39  22uF  [SMD Keramikkondensator 0805]
C40  22uF  [SMD Keramikkondensator 0805]
C41  22uF  [SMD Keramikkondensator 0805]
D1  SL1045  [SMD Diode TO-277]
D2  SL1045  [SMD Diode TO-277]
D3  MSK4005  [SMD Diode SOD-523]
D4  SL34F  [SMD Diode SMAF]
D5  SL34F  [SMD Diode SMAF]
L1  4.7µH  [SMD Inductor 5.5x5.2x3]
L2  3.3µH  [SMD Inductor 2x2.5x1.2]
P4  LED  [SMD LED 0603]  (value not drawn)
R15  91k  [SMD Widerstand 0402]
R16  147k  [SMD Widerstand 0402]
R17  10k  [SMD Widerstand 0402]
R18  20k  [SMD Widerstand 0402]
R19  1.0k  [SMD Widerstand 0402]
R20  91k  [SMD Widerstand 0402]
R21  20k  [SMD Widerstand 0402]
U8  RT6254AHGJ6F  [SMD IC TSOT-23-6]
U9  RT6254AHGJ6F  [SMD IC TSOT-23-6]

### Ports
BAT1, BAT2, V_BAT (out)

### Nets
3V3: C38.2 C39.2 C40.2 D3.K L2.2 R20.2
5V: C32.2 C33.2 C34.2 L1.2 R16.2
GND: C30.M(-) C33.1 C34.1 C35.1 C36.1 C39.1 C40.1 C41.1 P4.K R17.1 R18.1 R21.1 U8.3(GND) U9.3(GND)
VBAT: C30.P(+) C35.2 D1.K D2.K D5.A R15.2 U8.2(EN) U8.4(VIN)
VBUS: D4.A R19.2
V_BAT: C36.2 D3.A R15.1 R17.2 ; port V_BAT
NetC31_1: C31.1 U8.6(BOOT)
NetC31_2: C31.2 L1.1 U8.5(LX)
NetC32_1: C32.1 R16.1 R18.2 U8.1(FB)
NetC37_1: C37.1 U9.6(BOOT)
NetC37_2: C37.2 L2.1 U9.5(LX)
NetC38_1: C38.1 R20.1 R21.2 U9.1(FB)
NetC41_2: C41.2 D4.K D5.K U9.2(EN) U9.4(VIN)
NetD1_A: D1.A ; port BAT1
NetD2_A: D2.A ; port BAT2
NetP4_A: P4.A R19.1

### Notes on the sheet
- Title
- Author:
- Subtitle
- Date:
- Rev:
- File:
- Sheet
- of
- (in symbol LED) GR

### Library data of the parts
C30 = 100uF / 35V: 7.7mm 6.3mm 50V 47uF 2000hrs 105℃ -55℃~+105℃ SMD,6.3x7.7mm Aluminum Electrolytic Capacitors - SMD ROHS; ComponentLink1Description: Datasheet; ComponentLink1URL: https://datasheet.lcsc.com/lcsc/1809301215_Nichicon-UWT1V101MCL1GS_C125975.pdf; JLC: C125975
C31 C37 = E6 - 100nF: SMD Ceramic Capacitor E6; Unit Price: 0.01; Number: -; Supplier: -; JLC: C307331
C32 C38 = E6 - 47pF: SMD Ceramic Capacitor E6; Unit Price: 0.01; Number: -; Supplier: -; JLC: C1567
C33-C35 C39-C41 = E6 - 22uF: SMD Ceramic Capacitor E6; Unit Price: 0.01; Number: -; Supplier: -; JLC: C45783
C36 = E6 - 10nF: SMD Ceramic Capacitor E6; Unit Price: 0.01; Number: -; Supplier: -; JLC: C15195
D1 D2 = SL1045: as D7 on sheet CATS-EUROC-Pyro_Enable; ComponentLink1Description: Datasheet; ComponentLink1URL: https://datasheet.lcsc.com/lcsc/1810252210_MDD-Microdiode-Electronics--SL1045_C65021.pdf; JLC: C113945
D3 = MSK4005: SOD-523 Schottky Barrier Diode; ComponentLink1Description: Datasheet; ComponentLink1URL: https://datasheet.lcsc.com/lcsc/1912111437_Shikues-MSK4005_C345957.pdf; JLC: C345957
D4 D5 = SL34F: 3A SMAF Schottky Barrier Diode; JLC: C60396; ComponentLink1Description: Datasheet; ComponentLink1URL: https://datasheet.lcsc.com/lcsc/1809211527_MDD-Microdiode-Electronics--SL34F_C113938.pdf
L1 = Inductor 4.7µH / 4.5A: 4.7 µH Shielded Molded Inductor 4.5 A 60mOhm Max Nonstandard; Digikey: 541-1238-2-ND; ComponentLink1Description: Datasheet; ComponentLink1URL: https://www.vishay.com/docs/34260/ihlp2020cz11.pdf; JLC: C408410
L2 = Inductor 3.3µH / 1.15A: 1.15A 3.3uH ±20% 144mΩ SMD Power Inductors; Digikey: 732-5680-2-ND; ComponentLink1Description: Datasheet; ComponentLink1URL: https://datasheet.lcsc.com/lcsc/2110081330_Sunlord-SPH252012H3R3MT_C98379.pdf; JLC: C98379
P4 = LED: Color LED
R15 R20 = E24 - 91k: SMD Chip Resistor E24; Unit Price: 0.01; Number: -; Supplier: -; JLC: C4147
R16 = E96 - 147k: SMD Chip Resistor E96; Unit Price: 0.01; Number: -; Supplier: -; JLC: C64171
R17 = E24 - 10k: SMD Chip Resistor E24; Unit Price: 0.01; Number: -; Supplier: -; JLC: C25744
R18 R21 = E96 - 20k: SMD Chip Resistor E96; Unit Price: 0.01; Number: -; Supplier: -; JLC: C25765
R19 = E24 - 1.0k: SMD Chip Resistor E24; Unit Price: 0.01; Number: -; Supplier: -; JLC: C11702
U8 U9 = RT6254AHGJ6F: Buck Switching Regulator IC Positive Adjustable 0.6V 1 Output 4A SOT-23-6 Thin, TSOT-23-6; ComponentLink1Description: Datasheet; ComponentLink1URL: https://www.richtek.com/assets/product_file/RT6254A=RT6254B/DS6254AB-02.pdf; Digikey: RT6255AHGJ6FCT-ND

## Sheet CATS-EUROC-Telemetry.SchDoc: CATS EuRoC Edition
size A4; Author: Luca Jost; Revision: V1.0; SheetNumber: 11; SheetTotal: 16; Subtitle: Telemetry
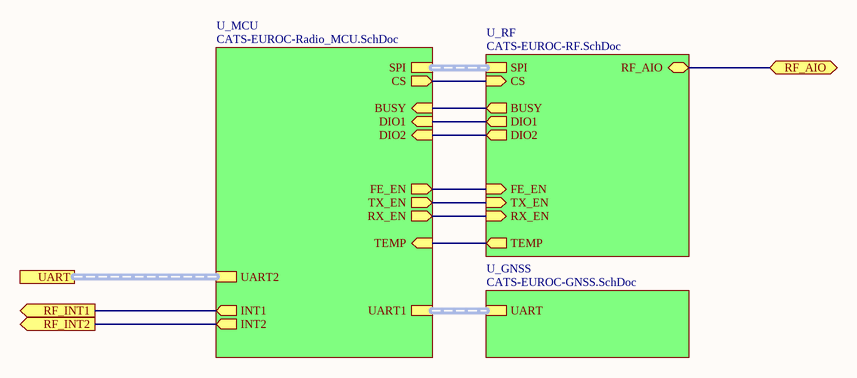
[diagram p10: CATS-EUROC-Telemetry.SchDoc]

### Sub-sheets
U_GNSS = CATS-EUROC-GNSS.SchDoc: UART (harness UART)
U_MCU = CATS-EUROC-Radio_MCU.SchDoc: SPI (harness SPI), CS (out), FE_EN (out), TX_EN (out), BUSY (in), DIO1 (in), DIO2 (in), TEMP (in), UART1 (harness UART), UART2 (harness UART), RX_EN (out), INT1 (out), INT2 (out)
U_RF = CATS-EUROC-RF.SchDoc: SPI (harness SPI), CS (in), BUSY (out), DIO1 (out), DIO2 (out), TEMP (out), FE_EN (in), TX_EN (in), RX_EN (in), RF_AIO (bidir)

### Ports
RF_AIO (bidir), RF_INT1 (out), RF_INT2 (out), UART

### Nets
BUSY: sheet U_MCU/BUSY, sheet U_RF/BUSY
CS: sheet U_MCU/CS, sheet U_RF/CS
DIO1: sheet U_MCU/DIO1, sheet U_RF/DIO1
DIO2: sheet U_MCU/DIO2, sheet U_RF/DIO2
FE_EN: sheet U_MCU/FE_EN, sheet U_RF/FE_EN
INT1: port RF_INT1, sheet U_MCU/INT1
INT2: port RF_INT2, sheet U_MCU/INT2
RX_EN: sheet U_MCU/RX_EN, sheet U_RF/RX_EN
TEMP: sheet U_MCU/TEMP, sheet U_RF/TEMP
TX_EN: sheet U_MCU/TX_EN, sheet U_RF/TX_EN
NetFL1_5: port RF_AIO, sheet U_RF/RF_AIO

### Buses and harness runs
harness port UART = sheet U_MCU/UART2
harness sheet U_GNSS/UART = sheet U_MCU/UART1
harness sheet U_MCU/SPI = sheet U_RF/SPI

### Notes on the sheet
- Title
- Author:
- Subtitle
- Date:
- Rev:
- File:
- Sheet
- of

## Sheet CATS-EUROC-Radio_MCU.SchDoc: CATS EuRoC Edition
size A4; Author: Luca Jost; Revision: V1.0; SheetNumber: 12; SheetTotal: 16; Subtitle: Radio Microprocessor
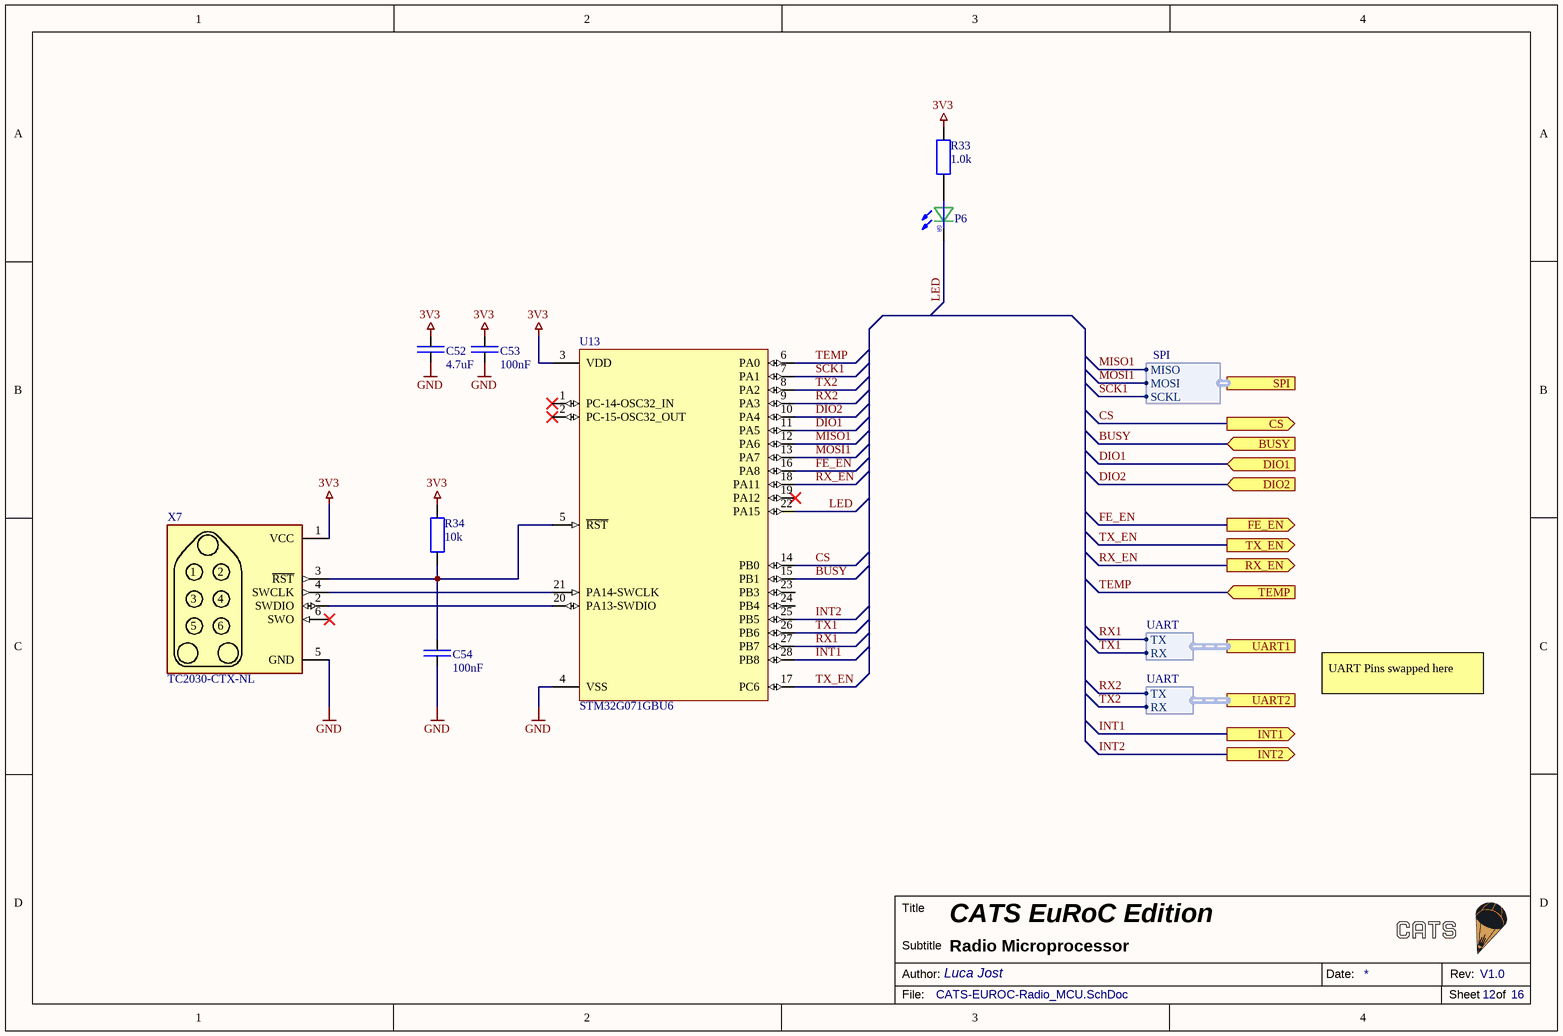
[diagram p11: CATS-EUROC-Radio_MCU.SchDoc]

### Parts
C52  4.7uF  [SMD Keramikkondensator 0402]
C53  100nF  [SMD Keramikkondensator 0402]
C54  100nF  [SMD Keramikkondensator 0402]
P6  LED  [SMD LED 0603]  (value not drawn)
R33  1.0k  [SMD Widerstand 0402]
R34  10k  [SMD Widerstand 0402]
U13  STM32G071GBU6  [SMD IC QFN-28 4x4]
X7  TC2030-CTX-NL  [SMD Connector TC2030]  (no BOM)

### Ports
BUSY (in), CS (out), DIO1 (in), DIO2 (in), FE_EN (out), INT1 (out), INT2 (out), RX_EN (out), SPI (harness SPI), TEMP (in), TX_EN (out), UART1 (harness UART), UART2 (harness UART)

### Harnesses
SPI: SCKL, MOSI, MISO
UART: TX, RX

### Nets
3V3: C52.2 C53.2 R33.2 R34.2 U13.3(VDD) X7.1(VCC)
GND: C52.1 C53.1 C54.1 U13.4(VSS) X7.5(GND)
BUSY: U13.15(PB1) ; port BUSY
CS: U13.14(PB0) ; port CS
DIO1: U13.11(PA5) ; port DIO1
DIO2: U13.10(PA4) ; port DIO2
FE_EN: U13.16(PA8) ; port FE_EN
INT1: U13.28(PB8) ; port INT1
INT2: U13.25(PB5) ; port INT2
LED: P6.K U13.22(PA15)
MISO1: U13.12(PA6) ; port SPI.MISO
MOSI1: U13.13(PA7) ; port SPI.MOSI
RX1: U13.27(PB7) ; port UART1.TX
RX2: U13.9(PA3) ; port UART2.TX
RX_EN: U13.18(PA11) ; port RX_EN
SCK1: U13.7(PA1) ; port SPI.SCKL
TEMP: U13.6(PA0) ; port TEMP
TX1: U13.26(PB6) ; port UART1.RX
TX2: U13.8(PA2) ; port UART2.RX
TX_EN: U13.17(PC6) ; port TX_EN
NetC54_2: C54.2 R34.1 U13.5(~{RST}) X7.3(~{RST})
NetP6_A: P6.A R33.1
NetU13_20: U13.20(PA13-SWDIO) X7.2(SWDIO)
NetU13_21: U13.21(PA14-SWCLK) X7.4(SWCLK)

Not connected (* = marked no-connect by the designer): U13 1(PC-14-OSC32_IN)* 2(PC-15-OSC32_OUT)* 19(PA12)* 23(PB3) 24(PB4); X7 6(SWO)*

### Notes on the sheet
- UART Pins swapped here
- Title
- Author:
- Subtitle
- Date:
- Rev:
- File:
- Sheet
- of
- (in symbol LED) GR

### Library data of the parts
C52 = E6 - 4.7uF: SMD Ceramic Capacitor E6; Unit Price: 0.01; Number: -; Supplier: -; JLC: C23733
C53 C54 = E6 - 100nF: SMD Ceramic Capacitor E6; Unit Price: 0.01; Number: -; Supplier: -; JLC: C307331
P6 = LED: Color LED
R33 = E24 - 1.0k: SMD Chip Resistor E24; Unit Price: 0.01; Number: -; Supplier: -; JLC: C11702
R34 = E24 - 10k: SMD Chip Resistor E24; Unit Price: 0.01; Number: -; Supplier: -; JLC: C25744
U13 = STM32G071GBU6: ARM® Cortex®-M0+ series Microcontroller IC 32-Bit 64MHz 128KB (128K x 8) FLASH 28-UFQFPN (4x4); Digikey: 497-18343-ND; JLC: C529347; ComponentLink1Description: Datasheet; ComponentLink1URL: https://media.digikey.com/pdf/Data%20Sheets/ST%20Microelectronics%20PDFS/STM32G071_Rev1_DS.pdf
X7 = TC2030-CTX-NL: Tag-Connect for ARM-Cortex (6-Pin)

## Sheet CATS-EUROC-RF.SchDoc: CATS EuRoC Edition
size A4; Author: Luca Jost; Revision: V1.0; SheetNumber: 13; SheetTotal: 16; Subtitle: RF
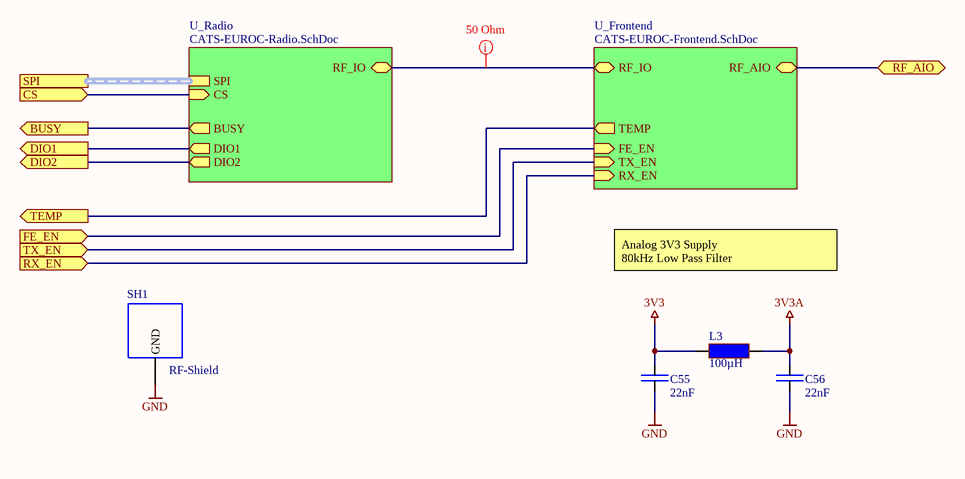
[diagram p12: CATS-EUROC-RF.SchDoc]

### Parts
C55  22nF  [SMD Keramikkondensator 0805]
C56  22nF  [SMD Keramikkondensator 0805]
L3  100µH  [SMD Inductor 1812]
SH1  RF-Shield  [SMD Shield MS183-10]

### Sub-sheets
U_Frontend = CATS-EUROC-Frontend.SchDoc: FE_EN (in), TX_EN (in), TEMP (out), RF_IO (bidir), RX_EN (in), RF_AIO (bidir)
U_Radio = CATS-EUROC-Radio.SchDoc: SPI (harness SPI), CS (in), BUSY (out), DIO1 (out), DIO2 (out), RF_IO (bidir)

### Ports
BUSY (out), CS (in), DIO1 (out), DIO2 (out), FE_EN (in), RF_AIO (bidir), RX_EN (in), SPI (harness SPI), TEMP (out), TX_EN (in)

### Nets
3V3: C55.2 L3.1
3V3A: C56.2 L3.2
GND: C55.1 C56.1 SH1.1(GND)
BUSY: port BUSY, sheet U_Radio/BUSY
CS: port CS, sheet U_Radio/CS
DIO1: port DIO1, sheet U_Radio/DIO1
DIO2: port DIO2, sheet U_Radio/DIO2
FE_EN: port FE_EN, sheet U_Frontend/FE_EN
RX_EN: port RX_EN, sheet U_Frontend/RX_EN
TEMP: port TEMP, sheet U_Frontend/TEMP
TX_EN: port TX_EN, sheet U_Frontend/TX_EN
NetFL1_5: port RF_AIO, sheet U_Frontend/RF_AIO
NetU3_5: sheet U_Frontend/RF_IO, sheet U_Radio/RF_IO

### Buses and harness runs
harness port SPI = sheet U_Radio/SPI

### Layout directives
rule Impedance Constraint [Min = 50.00    Max = 50.00    ]: NetU3_5

### Notes on the sheet
- Analog 3V3 Supply
  80kHz Low Pass Filter
- Title
- Author:
- Subtitle
- Date:
- Rev:
- File:
- Sheet
- of

### Library data of the parts
C55 C56 = E6 - 22nF: SMD Ceramic Capacitor E6; Unit Price: 0.01; Number: -; Supplier: -; JLC: C1729
L3 = Inductor 100µH / 0.25A: 0.25A 100µH ±20% 144mΩ SMD Power Inductors; ComponentLink1Description: Datasheet; ComponentLink1URL: https://datasheet.lcsc.com/lcsc/2110081330_Sunlord-SPH252012H3R3MT_C98379.pdf; JLC: C76822
SH1 = RF-Shield 18x10mm: RF Shield Shield, 1-Piece 0.413" (10.50mm) X 0.720" (18.30mm) Non-Vented Solder; ComponentLink1Description: Datasheet; ComponentLink1URL: https://www.masach.com/media/catalog/product/file/MS183-10.pdf; Digikey: 2333-MS183-10S-ND

## Sheet CATS-EUROC-Frontend.SchDoc: CATS EuRoC Edition
size A4; Author: Luca Jost; Revision: V1.0; SheetNumber: 15; SheetTotal: 16; Subtitle: Front End
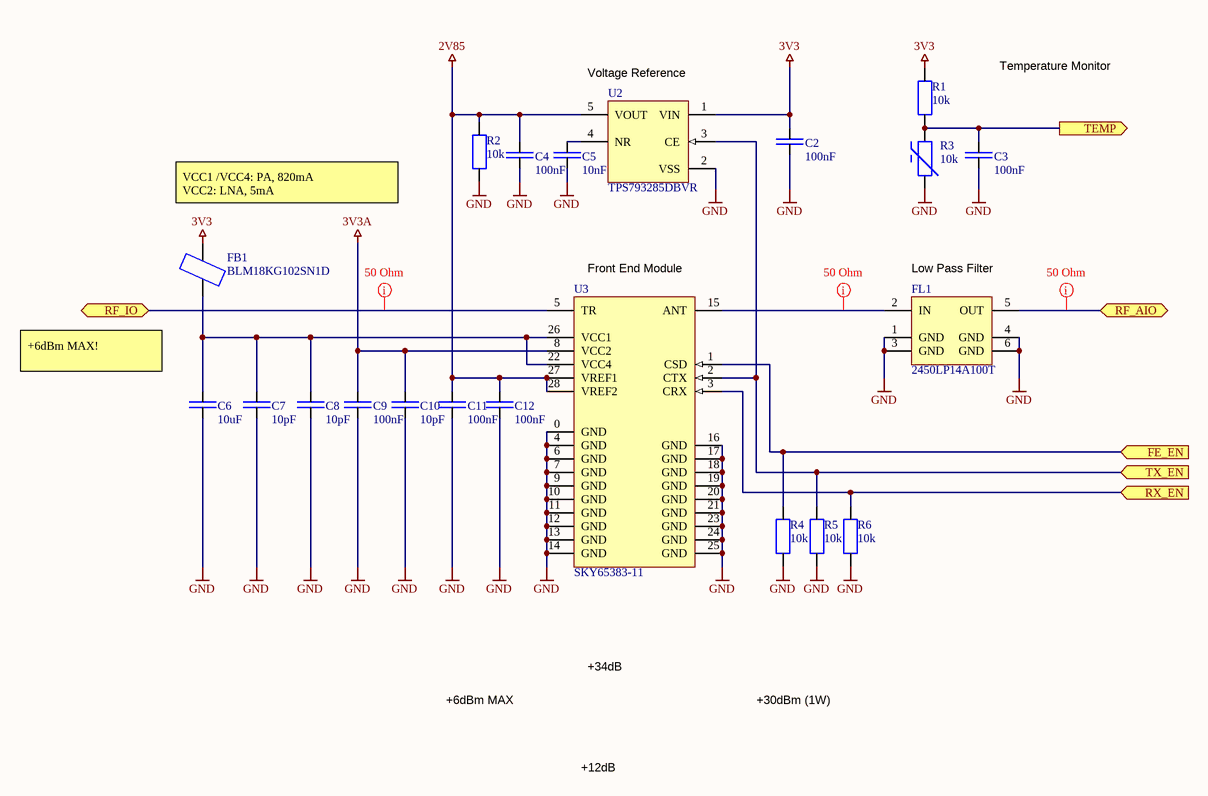
[diagram p13: CATS-EUROC-Frontend.SchDoc]

### Parts
C2  100nF  [SMD Keramikkondensator 0402]
C3  100nF  [SMD Keramikkondensator 0402]
C4  100nF  [SMD Keramikkondensator 0402]
C5  10nF  [SMD Keramikkondensator 0402]
C6  10uF  [SMD Keramikkondensator 0603]
C7  10pF  [SMD Keramikkondensator 0402]
C8  10pF  [SMD Keramikkondensator 0402]
C9  100nF  [SMD Keramikkondensator 0402]
C10  10pF  [SMD Keramikkondensator 0402]
C11  100nF  [SMD Keramikkondensator 0402]
C12  100nF  [SMD Keramikkondensator 0402]
FB1  BLM18KG102SN1D  [SMD Ferrite Bead 0603]
FL1  2450LP14A100T  [SMD Filter 2450LP14A100T]
R1  10k  [SMD Widerstand 0402]
R2  10k  [SMD Widerstand 0402]
R3  10k  [SMD Ferrite Bead 0402]
R4  10k  [SMD Widerstand 0402]
R5  10k  [SMD Widerstand 0402]
R6  10k  [SMD Widerstand 0402]
U2  TPS793285DBVR  [SMD IC SOT-23-5]
U3  SKY65383-11  [SMD IC 28-MCM]

### Ports
FE_EN (in), RF_AIO (bidir), RF_IO (bidir), RX_EN (in), TEMP (out), TX_EN (in)

### Nets
2V85: C4.2 C11.2 C12.2 R2.2 U2.5(VOUT) U3.27(VREF1) U3.28(VREF2)
3V3: C2.2 FB1.2 R1.2 U2.1(VIN)
3V3A: C9.2 C10.2 U3.8(VCC2)
GND: C2.1 C3.1 C4.1 C5.1 C6.1 C7.1 C8.1 C9.1 C10.1 C11.1 C12.1 FL1.1(GND) FL1.3(GND) FL1.4(GND) FL1.6(GND) R2.1 R3.2 R4.1 R5.1 R6.1 U2.2(VSS) U3.0(GND) U3.4(GND) U3.6(GND) U3.7(GND) U3.9(GND) U3.10(GND) U3.11(GND) U3.12(GND) U3.13(GND) U3.14(GND) U3.16(GND) U3.17(GND) U3.18(GND) U3.19(GND) U3.20(GND) U3.21(GND) U3.23(GND) U3.24(GND) U3.25(GND)
FE_EN: R4.2 U3.1(CSD) ; port FE_EN
RX_EN: R6.2 U3.3(CRX) ; port RX_EN
TEMP: C3.2 R1.1 R3.1 ; port TEMP
TX_EN: R5.2 U2.3(CE) U3.2(CTX) ; port TX_EN
NetC5_2: C5.2 U2.4(NR)
NetC6_2: C6.2 C7.2 C8.2 FB1.1 U3.22(VCC4) U3.26(VCC1)
NetFL1_2: FL1.2(IN) U3.15(ANT)
NetFL1_5: FL1.5(OUT) ; port RF_AIO
NetU3_5: U3.5(TR) ; port RF_IO

### Layout directives
rule Impedance Constraint [Min = 50.00    Max = 50.00    ]; net class RF-Line 50: NetFL1_2, NetFL1_5, NetU3_5

### Notes on the sheet
- (near U2) Voltage Reference
- Temperature Monitor
- VCC1 /VCC4: PA, 820mA
  VCC2: LNA, 5mA
- (near U3) Front End Module
- (near FL1) Low Pass Filter
- +6dBm MAX!
- +6dBm MAX
- +34dB
- +30dBm (1W)
- +12dB
- Title
- Author:
- Subtitle
- Date:
- Rev:
- File:
- Sheet
- of

### Library data of the parts
C2-C4 C9 C11 C12 = E6 - 100nF: SMD Ceramic Capacitor E6; Unit Price: 0.01; Number: -; Supplier: -; JLC: C307331
C5 = E6 - 10nF: SMD Ceramic Capacitor E6; Unit Price: 0.01; Number: -; Supplier: -; JLC: C15195
C6 = E6 - 10uF: SMD Ceramic Capacitor E6; Unit Price: 0.01; Number: -; Supplier: -; JLC: C96446
C7 C8 C10 = E6 - 10pF: SMD Ceramic Capacitor E6; Unit Price: 0.01; Number: -; Supplier: -; JLC: C32949
FB1 = BLM18KG102SN1D: 1 kOhms @ 100MHz 1 Power Line Ferrite Bead 0603 (1608 Metric) 1A 200mOhm; ComponentLink1Description: Datasheet; ComponentLink1URL: https://www.murata.com/en-us/products/productdata/8796738650142/ENFA0003.pdf; Digikey: 490-17349-1-ND; JLC: C42102
FL1 = 2450LP14A100T: 2.45GHz Center Frequency Low Pass RF Filter (Radio Frequency) 100MHz Bandwidth 0.5dB 0603 (1608 Metric), 6 PC Pad; ComponentLink1Description: Datasheet; ComponentLink1URL: https://www.johansontechnology.com/datasheets/2450LP14A100/2450LP14A100.pdf; Digikey: 712-1129-2-ND
R1 R2 R4-R6 = E24 - 10k: SMD Chip Resistor E24; Unit Price: 0.01; Number: -; Supplier: -; JLC: C25744
R3 = NCU15XH103F6SRC: 10kΩ -40℃~+125℃ 3455K 0.1mA 3434K ±1% 3380K ±1% 0402 NTC Thermistors; ComponentLink1Description: Datasheet; ComponentLink1URL: https://datasheet.lcsc.com/lcsc/1912111437_Murata-Electronics-NCU15XH103F6SRC_C333993.pdf; JLC: C333993
U2 = TPS793285DBVR: Linear Voltage Regulator IC Positive Fixed 1 Output  200mA SOT-23-5 2.85V; ComponentLink1Description: Datasheet; ComponentLink1URL: https://media.digikey.com/pdf/Data%20Sheets/Texas%20Instruments%20PDFs/TPS793_Rev2015.pdf; Digikey: 296-12157-1-ND
U3 = SKY65383-11: 2400 to 2483 MHz Transmit/Receive / Front-End Module +30dBm; ComponentLink1Description: Datasheet; ComponentLink1URL: https://www.skyworksinc.com/-/media/SkyWorks/Documents/Products/2901-3000/SKY65383-11_202668G.pdf; Digikey: 863-1798-1-ND

## Sheet CATS-EUROC-Radio.SchDoc: CATS EuRoC Edition
size A4; Author: Luca Jost; Revision: V1.0; SheetNumber: 14; SheetTotal: 16; Subtitle: Radio
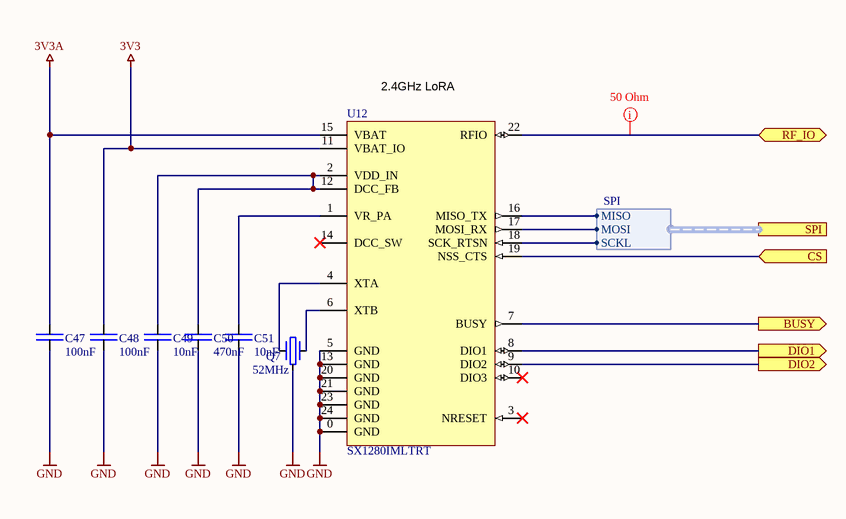
[diagram p14: CATS-EUROC-Radio.SchDoc]

### Parts
C47  100nF  [SMD Keramikkondensator 0402]
C48  100nF  [SMD Keramikkondensator 0402]
C49  10nF  [SMD Keramikkondensator 0402]
C50  470nF  [SMD Keramikkondensator 0402]
C51  10nF  [SMD Keramikkondensator 0402]
Q7  52MHz  [SMD Crystal 1.2X1.0X0.35]
U12  SX1280IMLTRT  [SMD IC QFN-24]

### Ports
BUSY (out), CS (in), DIO1 (out), DIO2 (out), RF_IO (bidir), SPI (harness SPI)

### Harnesses
SPI: SCKL, MOSI, MISO

### Nets
3V3: C48.2 U12.11(VBAT_IO)
3V3A: C47.2 U12.15(VBAT)
GND: C47.1 C48.1 C49.1 C50.1 C51.1 Q7.3 U12.0(GND) U12.5(GND) U12.13(GND) U12.20(GND) U12.21(GND) U12.23(GND) U12.24(GND)
BUSY: U12.7(BUSY) ; port BUSY
CS: U12.19(NSS_CTS) ; port CS
DIO1: U12.8(DIO1) ; port DIO1
DIO2: U12.9(DIO2) ; port DIO2
MISO1: U12.16(MISO_TX) ; port SPI.MISO
MOSI1: U12.17(MOSI_RX) ; port SPI.MOSI
SCK1: U12.18(SCK_RTSN) ; port SPI.SCKL
NetC49_2: C49.2 C50.2 U12.2(VDD_IN) U12.12(DCC_FB)
NetC51_2: C51.2 U12.1(VR_PA)
NetQ7_1: Q7.1 U12.4(XTA)
NetQ7_2: Q7.2 U12.6(XTB)
NetU3_5: U12.22(RFIO) ; port RF_IO

Not connected (* = marked no-connect by the designer): U12 3(NRESET)* 10(DIO3)* 14(DCC_SW)*

### Layout directives
rule Impedance Constraint [Min = 50.00    Max = 50.00    ]; net class RF-Line 50: NetU3_5

### Notes on the sheet
- (near U12) 2.4GHz LoRA
- Title
- Author:
- Subtitle
- Date:
- Rev:
- File:
- Sheet
- of

### Library data of the parts
C47 C48 = E6 - 100nF: SMD Ceramic Capacitor E6; Unit Price: 0.01; Number: -; Supplier: -; JLC: C307331
C49 C51 = E6 - 10nF: SMD Ceramic Capacitor E6; Unit Price: 0.01; Number: -; Supplier: -; JLC: C15195
C50 = E6 - 470nF: SMD Ceramic Capacitor E6; Unit Price: 0.01; Number: -; Supplier: -; JLC: C47339
Q7 = Crystal 52MHz - R1210: 52 MHz ±7ppm Crystal 5pF 100 Ohms 4-SMD, No Lead; ComponentLink1Description: Datasheet; ComponentLink1URL: https://www.diodes.com/assets/Datasheets/FL.pdf; Digikey: 2151-R1210-52.000-5-F-0710-TR-ND
U12 = SX1280IMLTRT: Long Range, Low Power, 2.4 GHz / Transceiver with Ranging Capability; ComponentLink1Description: Datasheet; ComponentLink1URL: https://media.digikey.com/pdf/Data%20Sheets/Semtech%20PDFs/SX1280-81_Rev3.2_Mar2020.pdf; Digikey: SX1280IMLTRTCT-ND

## Sheet CATS-EUROC-GNSS.SchDoc: CATS EuRoC Edition
size A4; Author: Luca Jost; Revision: V1.0; SheetNumber: 16; SheetTotal: 16; Subtitle: GNSS
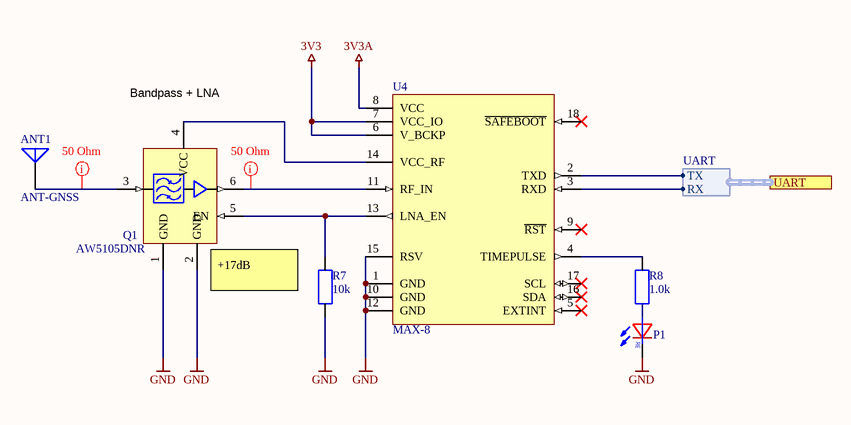
[diagram p15: CATS-EUROC-GNSS.SchDoc]

### Parts
ANT1  ANT-GNSS  [THT Antenna GNSS 18x18]
P1  LED  [SMD LED 0603]  (value not drawn)
Q1  AW5105DNR  [SMD LNA AW5105DNR]
R7  10k  [SMD Widerstand 0402]
R8  1.0k  [SMD Widerstand 0402]
U4  MAX-8  [SMD MAX-8]

### Ports
UART (harness UART)

### Harnesses
UART: TX, RX

### Nets
3V3: U4.6(V_BCKP) U4.7(VCC_IO)
3V3A: U4.8(VCC)
GND: P1.K Q1.1(GND) Q1.2(GND) R7.1 U4.1(GND) U4.10(GND) U4.12(GND) U4.15(RSV)
RX1: U4.2(TXD) ; port UART.TX
TX1: U4.3(RXD) ; port UART.RX
NetANT1_1: ANT1.1 Q1.3
NetP1_A: P1.A R8.1
NetQ1_4: Q1.4(VCC) U4.14(VCC_RF)
NetQ1_5: Q1.5(EN) R7.2 U4.13(LNA_EN)
NetQ1_6: Q1.6(EN) U4.11(RF_IN)
NetR8_2: R8.2 U4.4(TIMEPULSE)

Not connected (* = marked no-connect by the designer): U4 5(EXTINT)* 9(~{RST})* 16(SDA)* 17(SCL)* 18(~{SAFEBOOT})*

### Layout directives
rule Impedance Constraint [Min = 50.00    Max = 50.00    ]; net class RF-Line 50: NetANT1_1, NetQ1_6

### Notes on the sheet
- (near Q1) Bandpass + LNA
- (near Q1) +17dB
- Title
- Author:
- Subtitle
- Date:
- Rev:
- File:
- Sheet
- of
- (in symbol LED) RE

### Library data of the parts
ANT1 = ANT-GNSS: 1.575GHz GPS Ceramic Patch RF Antenna 1.573GHz ~ 1.577GHz 3.3dBic Pin Adhesive; ComponentLink1Description: Datasheet; ComponentLink1URL: https://abracon.com/patchantenna/APAE1575R1820ABDC1-T.pdf; Digikey: 535-11944-ND
P1 = LED: Color LED
Q1 = AW5105DNR: BDS/GPS/GNSS INTEGRATED FRONT-END MODULE WITH / LOW NOISE AMPLIFIER AND FILTER; ComponentLink1Description: Datasheet; ComponentLink1URL: https://datasheet.lcsc.com/lcsc/2008041805_AWINIC-Shanghai-Awinic-Tech-AW5105DNR_C506193.pdf; JLC: C506193
R7 = E24 - 10k: SMD Chip Resistor E24; Unit Price: 0.01; Number: -; Supplier: -; JLC: C25744
R8 = E24 - 1.0k: SMD Chip Resistor E24; Unit Price: 0.01; Number: -; Supplier: -; JLC: C11702
U4 = MAX-8: u-blox 8 GNSS modules; ComponentLink1Description: Datasheet; ComponentLink1URL: https://www.u-blox.com/sites/default/files/MAX-8_DataSheet_%28UBX-16000093%29.pdf; JLC: C90770; Digikey: 672-MAX-8C-0TR-ND

## Nets that join several sheets
3V3: CATS-EUROC-IMU (9 pins), CATS-EUROC-Baro (C1.2 U1.1), CATS-EUROC-MCU (16 pins), CH1 (D6_CH1.K), CH2 (D6_CH2.K), CATS-EUROC-Pyro_Enable (C45.2 R30.2 U11.5), CATS-EUROC-Storage (C57.2 U14.3 U14.7 U14.8), CATS-EUROC-PM (6 pins), CATS-EUROC-Radio_MCU (6 pins), CATS-EUROC-RF (C55.2 L3.1), CATS-EUROC-Frontend (C2.2 FB1.2 R1.2 U2.1), CATS-EUROC-Radio (C48.2 U12.11), CATS-EUROC-GNSS (U4.6 U4.7)
3V3A: CATS-EUROC-RF (C56.2 L3.2), CATS-EUROC-Frontend (C9.2 C10.2 U3.8), CATS-EUROC-Radio (C47.2 U12.15), CATS-EUROC-GNSS (U4.8)
5V: CATS-EUROC-Overview (X4.4 X5.3 X5.4), CATS-EUROC-MCU (C29.2 LS1.1), CH1 (U10_CH1.5), CH2 (U10_CH2.5), CATS-EUROC-PM (5 pins)
GND: CATS-EUROC-Overview (6 pins), CATS-EUROC-IMU (17 pins), CATS-EUROC-Baro (C1.1 U1.2 U1.3), CATS-EUROC-MCU (20 pins), CH1 (10 pins), CH2 (10 pins), CATS-EUROC-USB (9 pins), CATS-EUROC-Pyro_Enable (5 pins), CATS-EUROC-Storage (C57.1 U14.4), CATS-EUROC-PM (14 pins), CATS-EUROC-Radio_MCU (5 pins), CATS-EUROC-RF (C55.1 C56.1 SH1.1), CATS-EUROC-Frontend (40 pins), CATS-EUROC-Radio (13 pins), CATS-EUROC-GNSS (8 pins)
VBAT: CATS-EUROC-Pyro_Enable (Q5.S R28.2), CATS-EUROC-PM (8 pins)
VBUS: CATS-EUROC-USB (R35.1 X8.A4B9 X8.B4A9), CATS-EUROC-PM (D4.A R19.2)
BUSY: CATS-EUROC-Radio_MCU (U13.15), CATS-EUROC-Radio (U12.7)
CS: CATS-EUROC-Radio_MCU (U13.14), CATS-EUROC-Radio (U12.19)
CS_BARO: CATS-EUROC-Baro (U1.4 U1.5), CATS-EUROC-MCU (U7.19)
CS_IMU: CATS-EUROC-IMU (U5.5 U6.12), CATS-EUROC-MCU (U7.18)
DIO1: CATS-EUROC-Radio_MCU (U13.11), CATS-EUROC-Radio (U12.8)
DIO2: CATS-EUROC-Radio_MCU (U13.10), CATS-EUROC-Radio (U12.9)
FE_EN: CATS-EUROC-Radio_MCU (U13.16), CATS-EUROC-Frontend (R4.2 U3.1)
FLASH_CS: CATS-EUROC-MCU (U7.25), CATS-EUROC-Storage (U14.1)
INT1: CATS-EUROC-MCU (U7.29), CATS-EUROC-Radio_MCU (U13.28)
INT2: CATS-EUROC-MCU (U7.26), CATS-EUROC-Radio_MCU (U13.25)
IO1: CATS-EUROC-Overview (X4.1), CATS-EUROC-MCU (U7.43)
MISO1: CATS-EUROC-Radio_MCU (U13.12), CATS-EUROC-Radio (U12.16)
MOSI1: CATS-EUROC-Radio_MCU (U13.13), CATS-EUROC-Radio (U12.17)
NetD1_A: CATS-EUROC-Overview (X2.1), CATS-EUROC-PM (D1.A)
NetD2_A: CATS-EUROC-Overview (X2.5), CATS-EUROC-PM (D2.A)
NetFL1_5: CATS-EUROC-Overview (X6.1), CATS-EUROC-Frontend (FL1.5)
NetU3_5: CATS-EUROC-Frontend (U3.5), CATS-EUROC-Radio (U12.22)
PH1: CATS-EUROC-Overview (X3.2 X3.4), CH1 (C42_CH1.2 C43_CH1.2), CH2 (C42_CH2.2 C43_CH2.2), CATS-EUROC-Pyro_Enable (D7.K)
PL1: CATS-EUROC-Overview (X3.1), CH1 (Q4_CH1.D R22_CH1.2 R23_CH1.2)
PL2: CATS-EUROC-Overview (X3.3), CH2 (Q4_CH2.D R22_CH2.2 R23_CH2.2)
PYRO1: CATS-EUROC-MCU (U7.45), CH1 (R26_CH1.2 U10_CH1.3)
PYRO2: CATS-EUROC-MCU (U7.46), CH2 (R26_CH2.2 U10_CH2.3)
PYRO_EN: CATS-EUROC-MCU (U7.20), CATS-EUROC-Pyro_Enable (R32.2 U11.2)
RX1: CATS-EUROC-Radio_MCU (U13.27), CATS-EUROC-GNSS (U4.2)
RX2: CATS-EUROC-MCU (U7.30), CATS-EUROC-Radio_MCU (U13.9)
RX_EN: CATS-EUROC-Radio_MCU (U13.18), CATS-EUROC-Frontend (R6.2 U3.3)
SCK1: CATS-EUROC-Radio_MCU (U13.7), CATS-EUROC-Radio (U12.18)
SERVO1: CATS-EUROC-Overview (X5.5), CATS-EUROC-MCU (U7.40)
SERVO2: CATS-EUROC-Overview (X5.6), CATS-EUROC-MCU (U7.41)
SPI1_MISO: CATS-EUROC-IMU (U5.4 U6.1), CATS-EUROC-Baro (U1.6), CATS-EUROC-MCU (U7.16)
SPI1_MOSI: CATS-EUROC-IMU (U5.3 U6.14), CATS-EUROC-Baro (U1.7), CATS-EUROC-MCU (U7.17)
SPI1_SCK: CATS-EUROC-IMU (U5.2 U6.13), CATS-EUROC-Baro (U1.8), CATS-EUROC-MCU (U7.15)
SPI2_MISO: CATS-EUROC-MCU (U7.27), CATS-EUROC-Storage (U14.2)
SPI2_MOSI: CATS-EUROC-MCU (U7.28), CATS-EUROC-Storage (U14.5)
SPI2_SCK: CATS-EUROC-MCU (U7.21), CATS-EUROC-Storage (U14.6)
TEMP: CATS-EUROC-Radio_MCU (U13.6), CATS-EUROC-Frontend (C3.2 R1.1 R3.1)
TX1: CATS-EUROC-Radio_MCU (U13.26), CATS-EUROC-GNSS (U4.3)
TX2: CATS-EUROC-MCU (U7.31), CATS-EUROC-Radio_MCU (U13.8)
TX_EN: CATS-EUROC-Radio_MCU (U13.17), CATS-EUROC-Frontend (R5.2 U2.3 U3.2)
UART2_RX: CATS-EUROC-Overview (X4.3), CATS-EUROC-MCU (U7.13)
UART2_TX: CATS-EUROC-Overview (X4.2), CATS-EUROC-MCU (U7.12)
USB_DET: CATS-EUROC-MCU (U7.38), CATS-EUROC-USB (R35.2 R38.1)
USB_N: CATS-EUROC-MCU (U7.32), CATS-EUROC-USB (X8.A7 X8.B7)
USB_P: CATS-EUROC-MCU (U7.33), CATS-EUROC-USB (X8.A6 X8.B6)
V_BAT: CATS-EUROC-MCU (U7.10), CATS-EUROC-PM (C36.2 D3.A R15.1 R17.2)
V_PYRO1: CATS-EUROC-MCU (U7.14), CH1 (C44_CH1.2 D6_CH1.A R23_CH1.1 R27_CH1.2)
V_PYRO2: CATS-EUROC-MCU (U7.11), CH2 (C44_CH2.2 D6_CH2.A R23_CH2.1 R27_CH2.2)

## Assembly variants
ICM20601: not fitted C17 C18 U7
LSM6DSO32: not fitted C13 C14 C15 C16 U6